# EAGLE schematic main (EAGLE 7.6.0), part 1 of 3
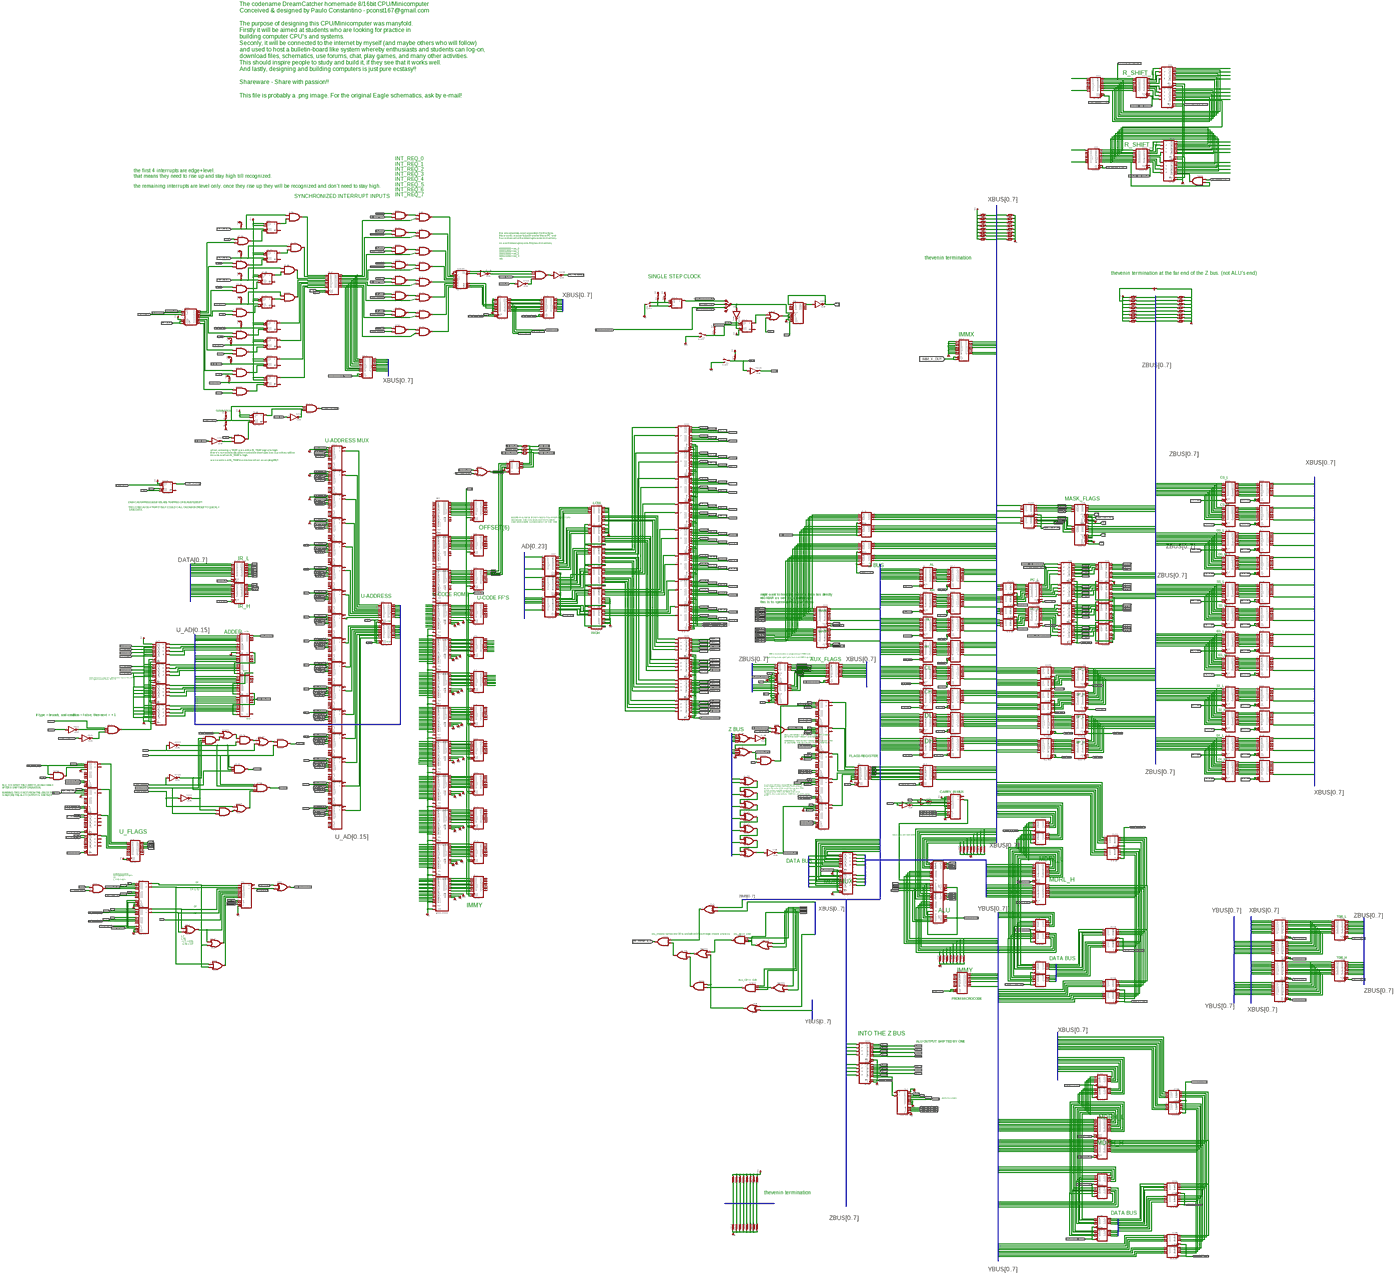
[diagram p0: schematic, sheet 1, overview]
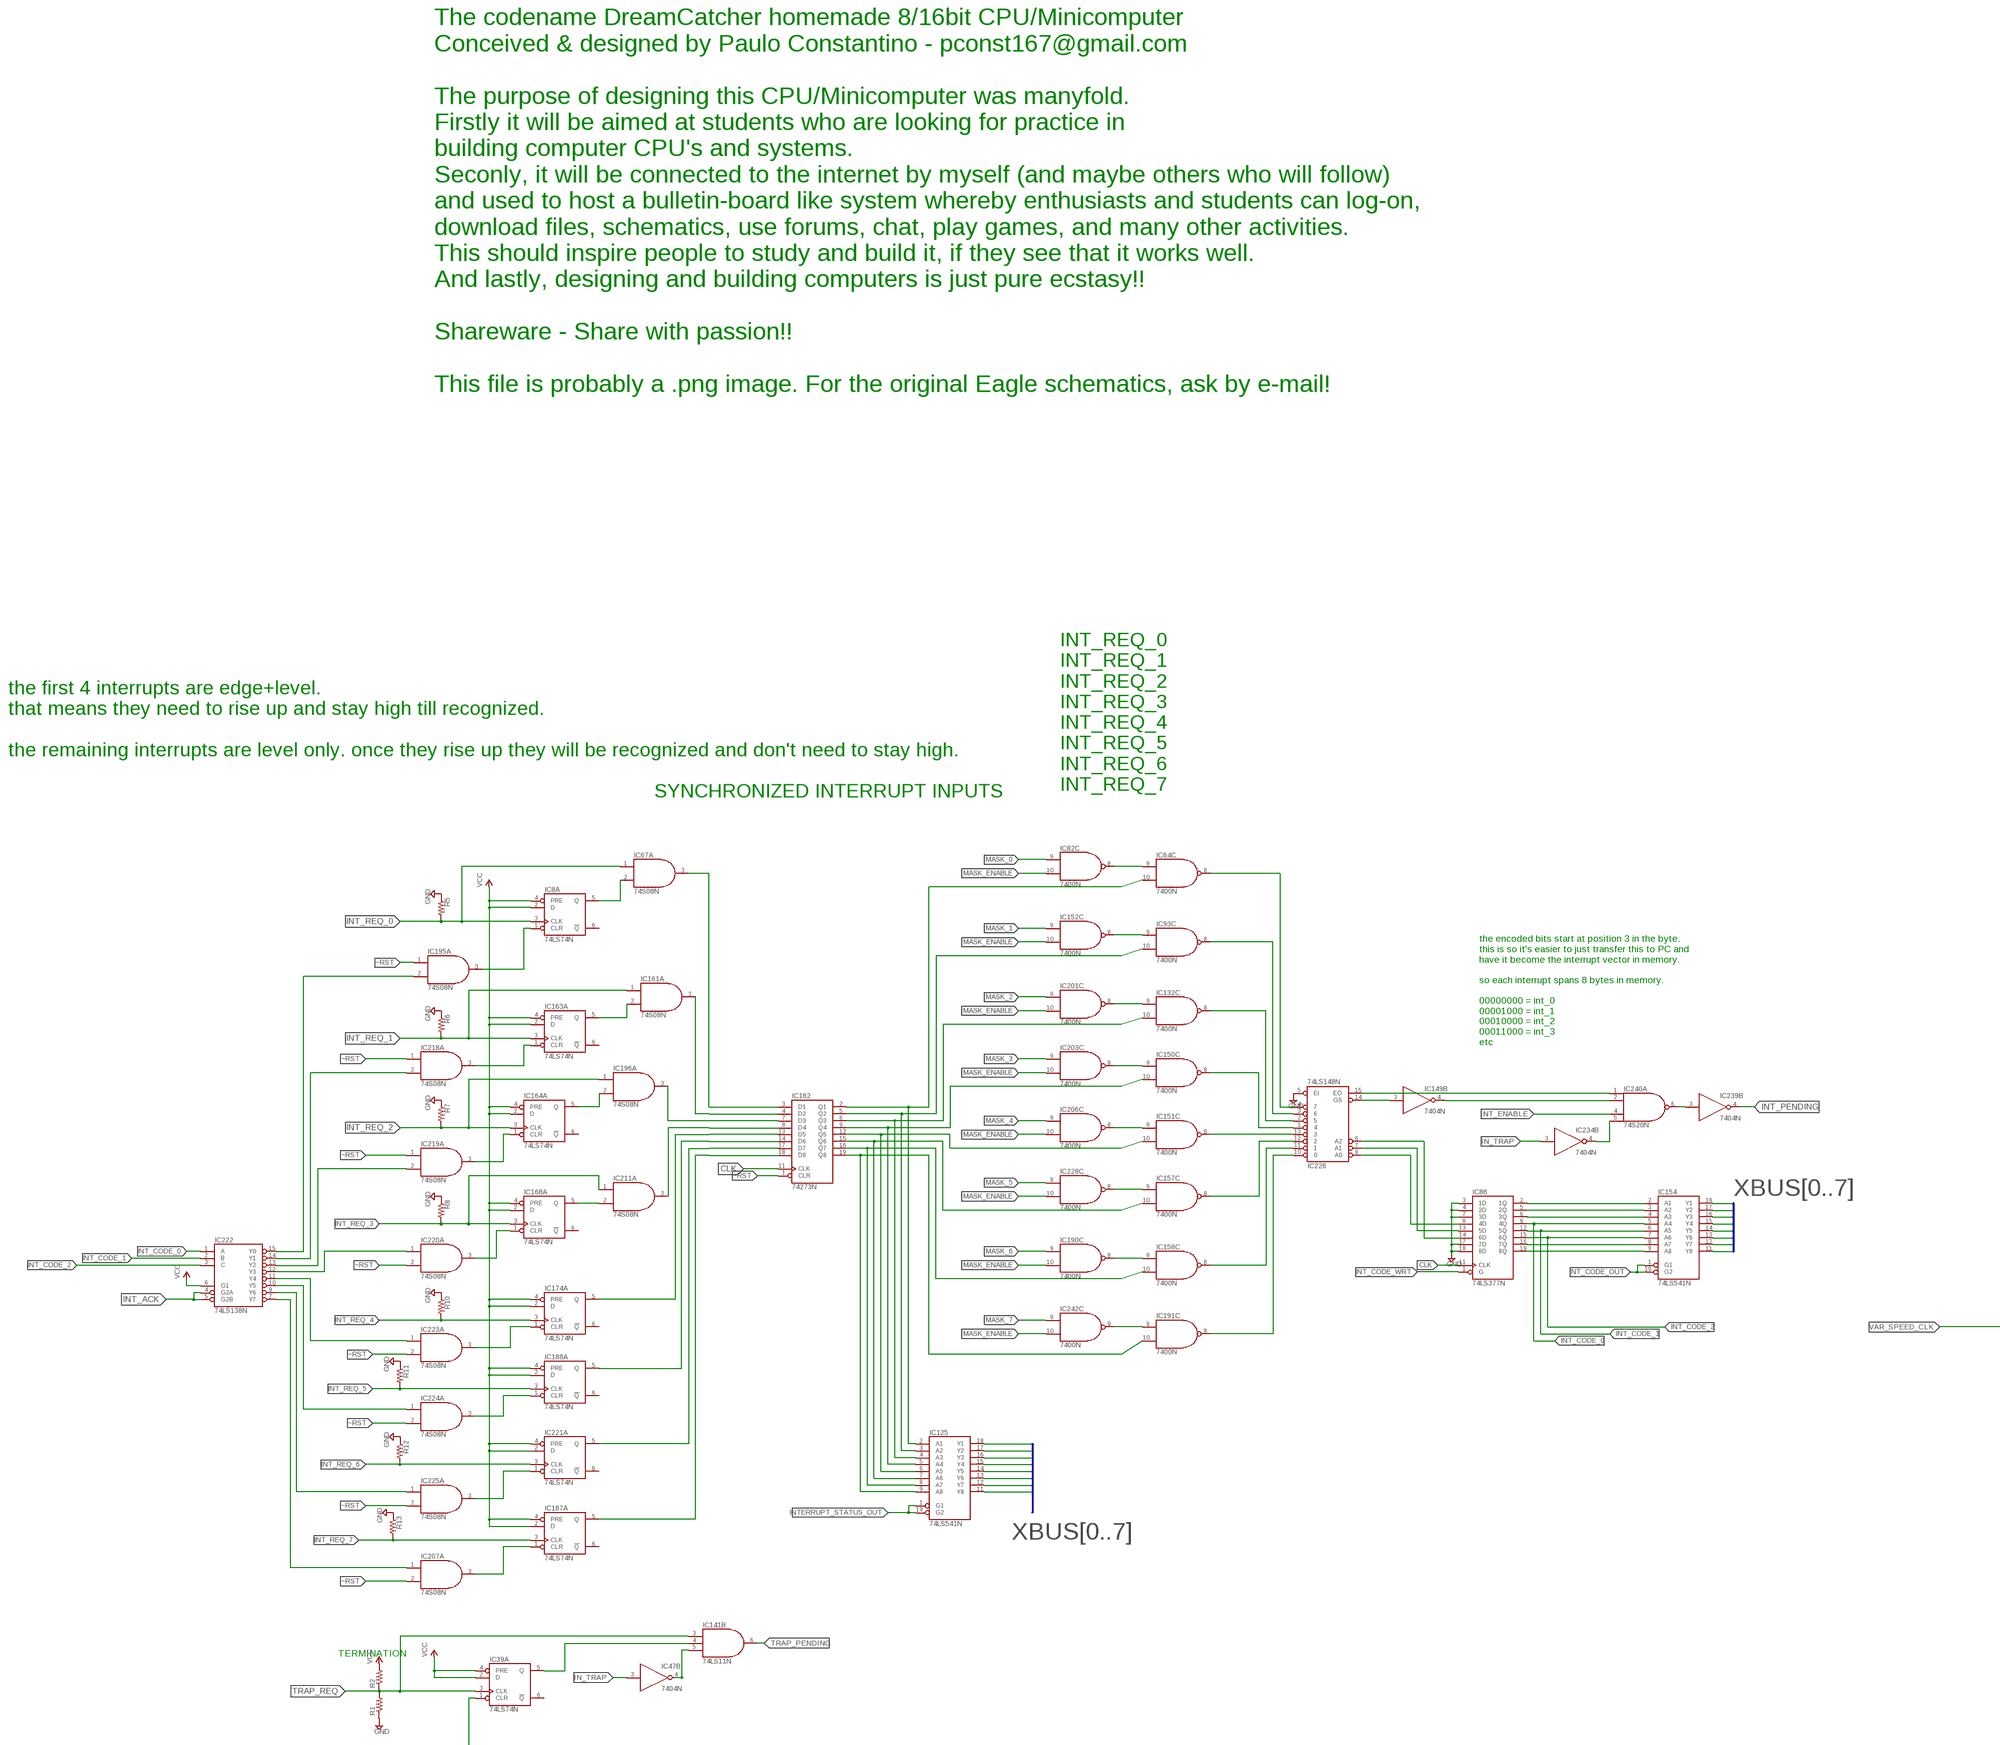
[diagram p1: schematic, sheet 1, part 1 of 7]
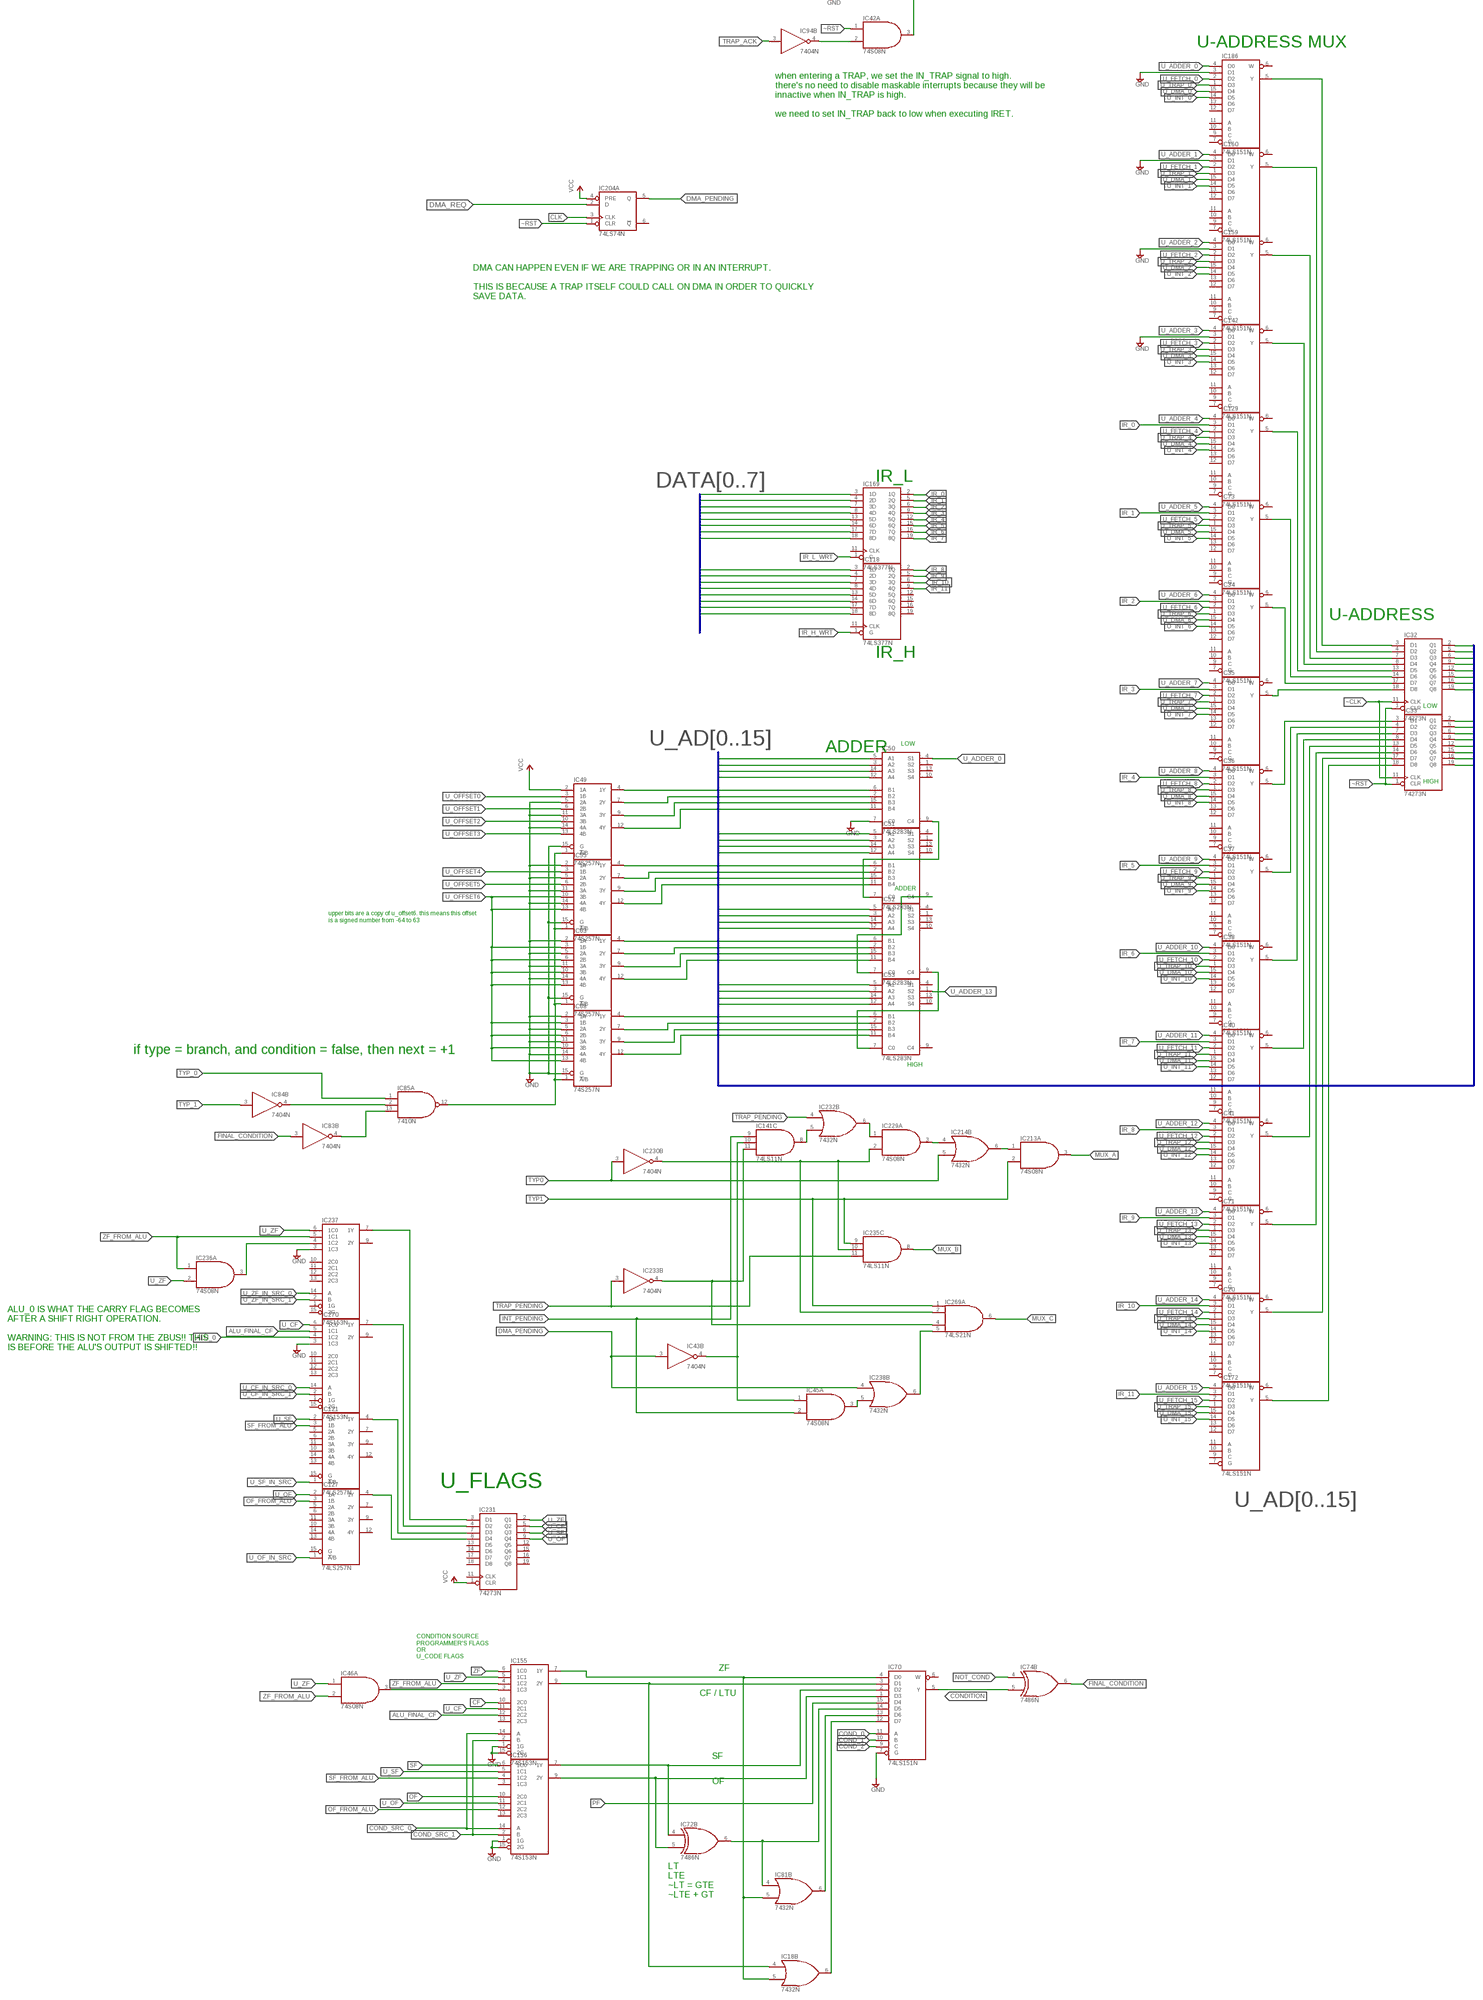
[diagram p2: schematic, sheet 1, part 2 of 7]
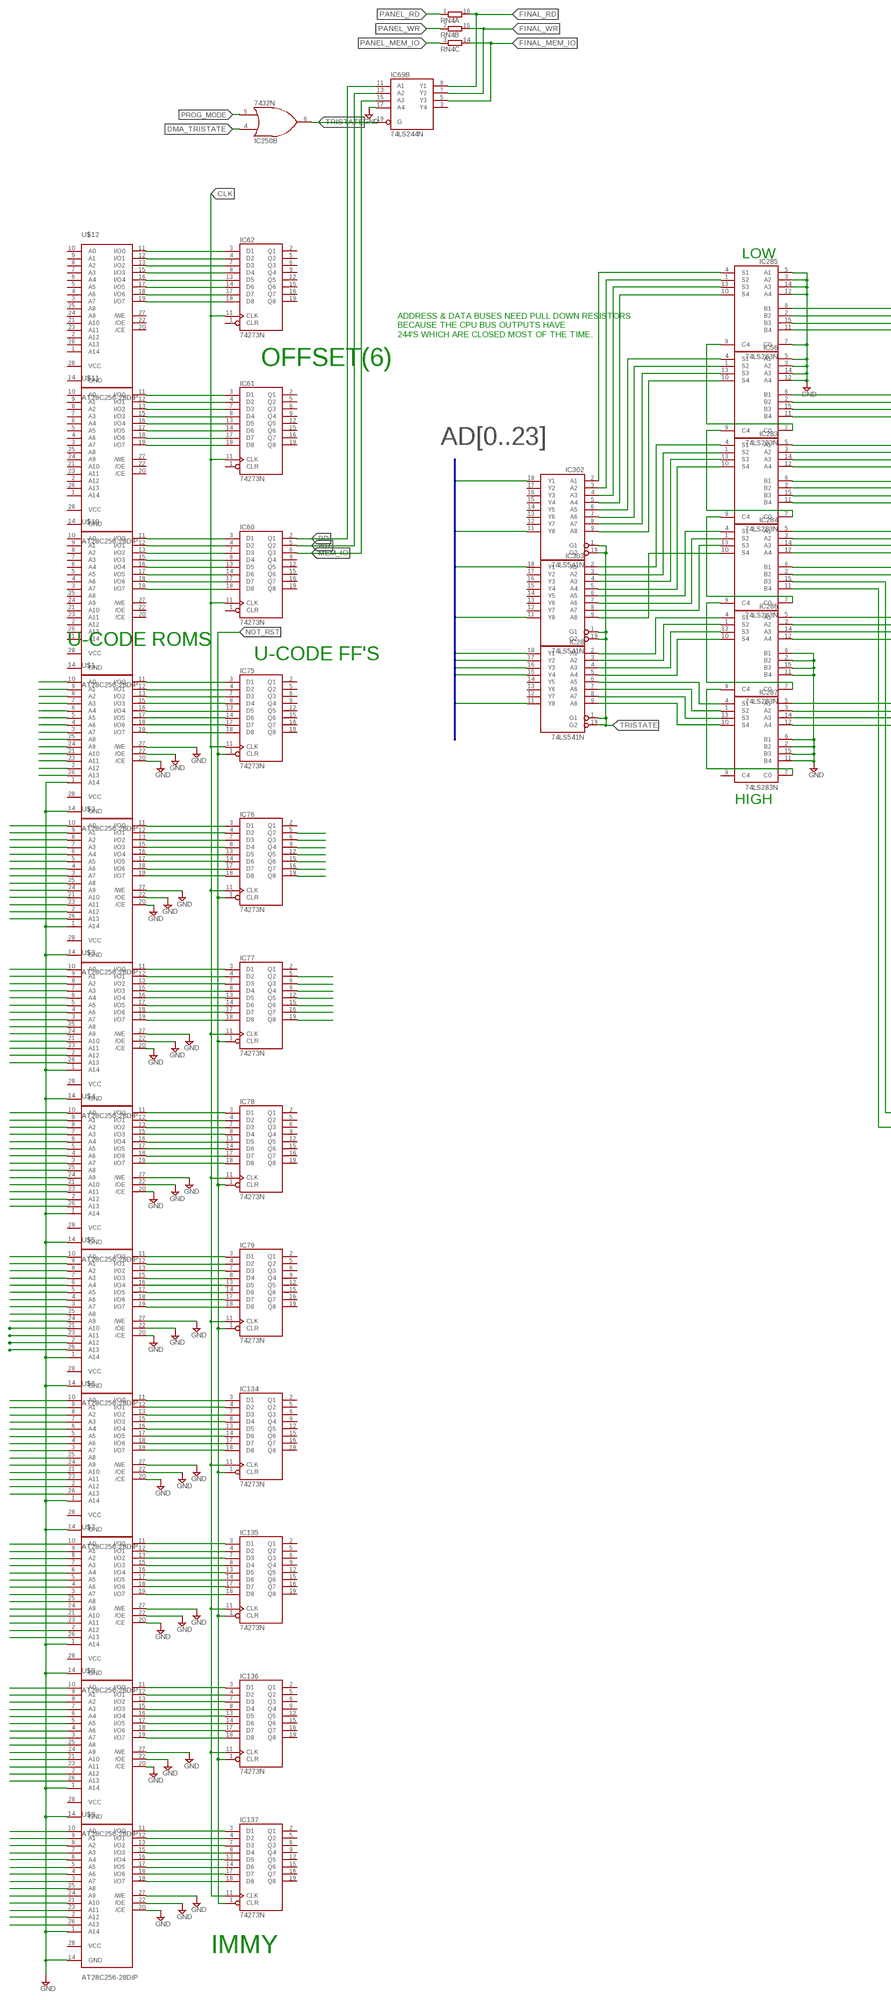
[diagram p3: schematic, sheet 1, part 3 of 7]
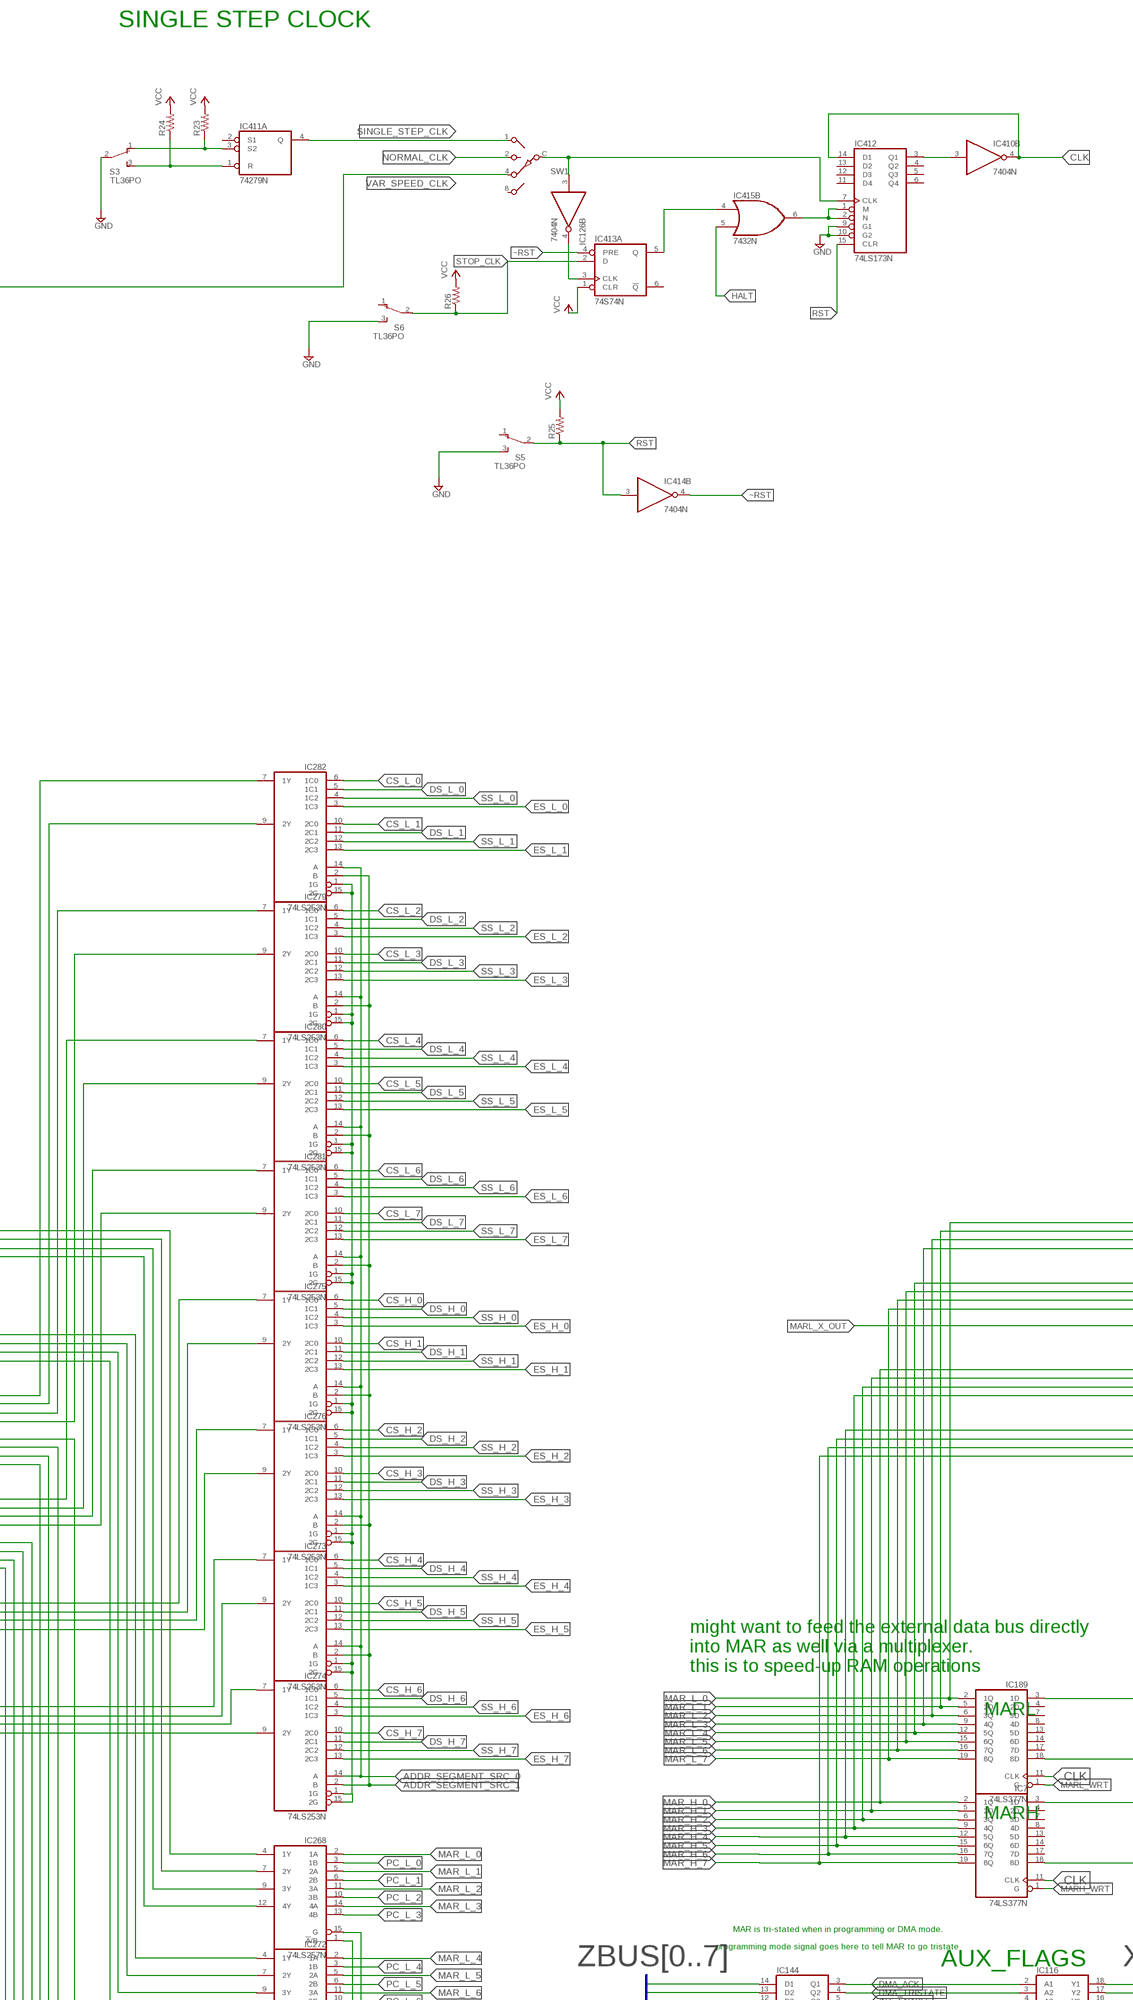
[diagram p4: schematic, sheet 1, part 4 of 7]
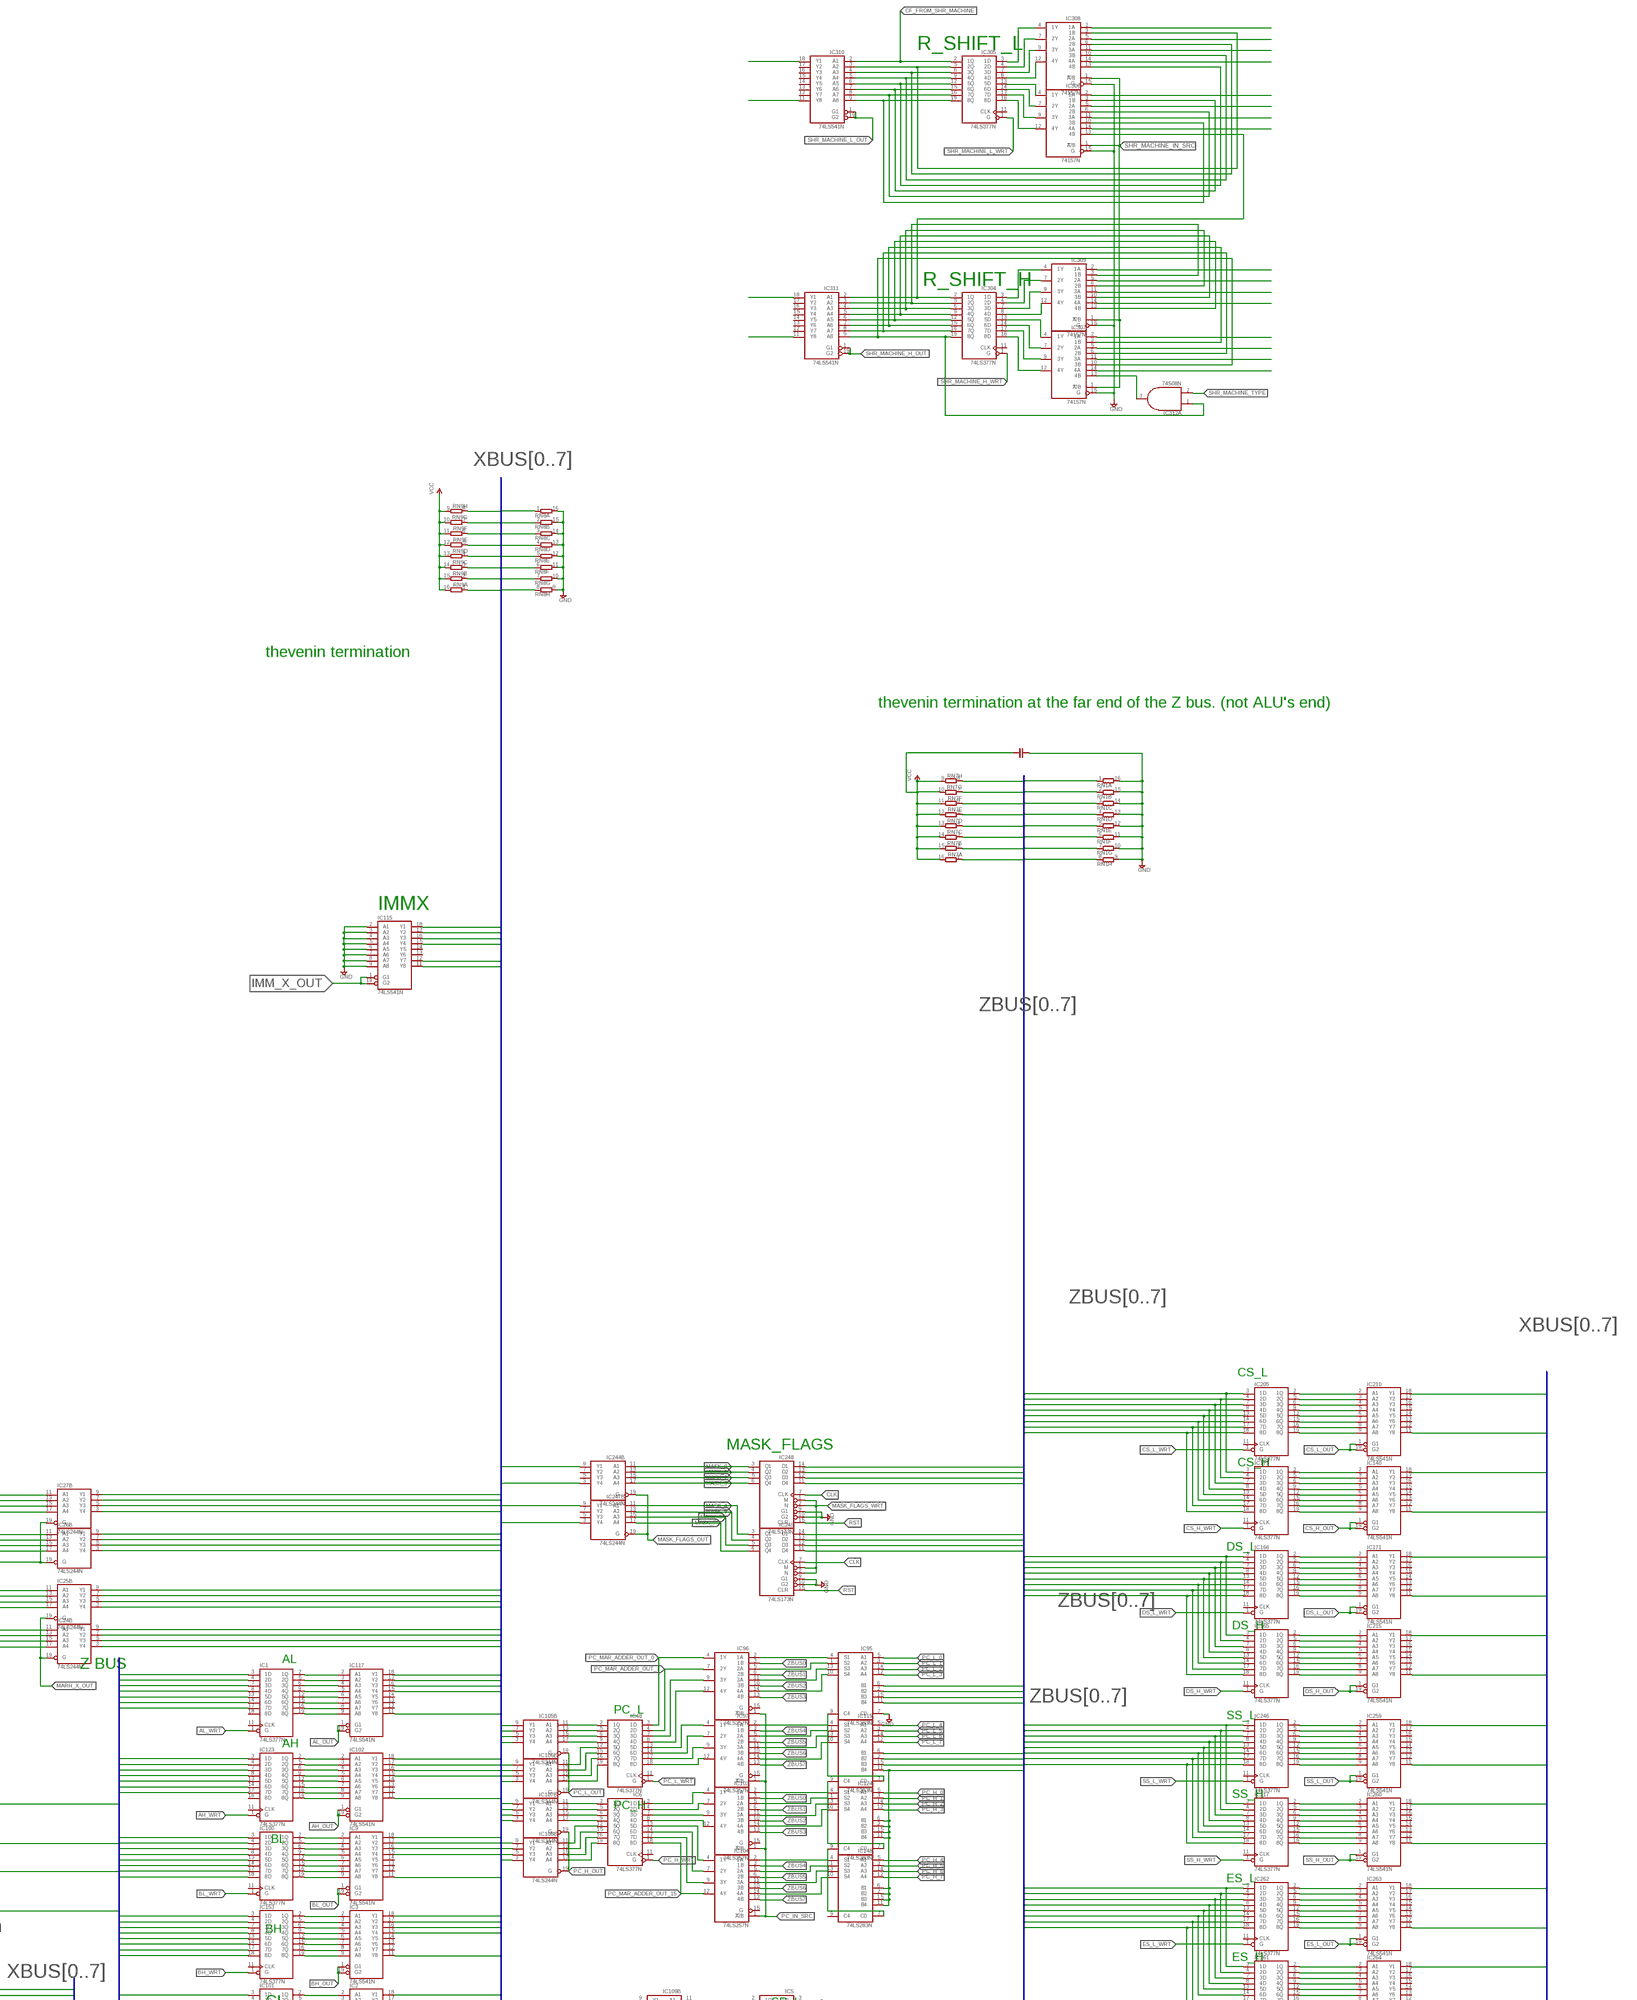
[diagram p5: schematic, sheet 1, part 5 of 7]
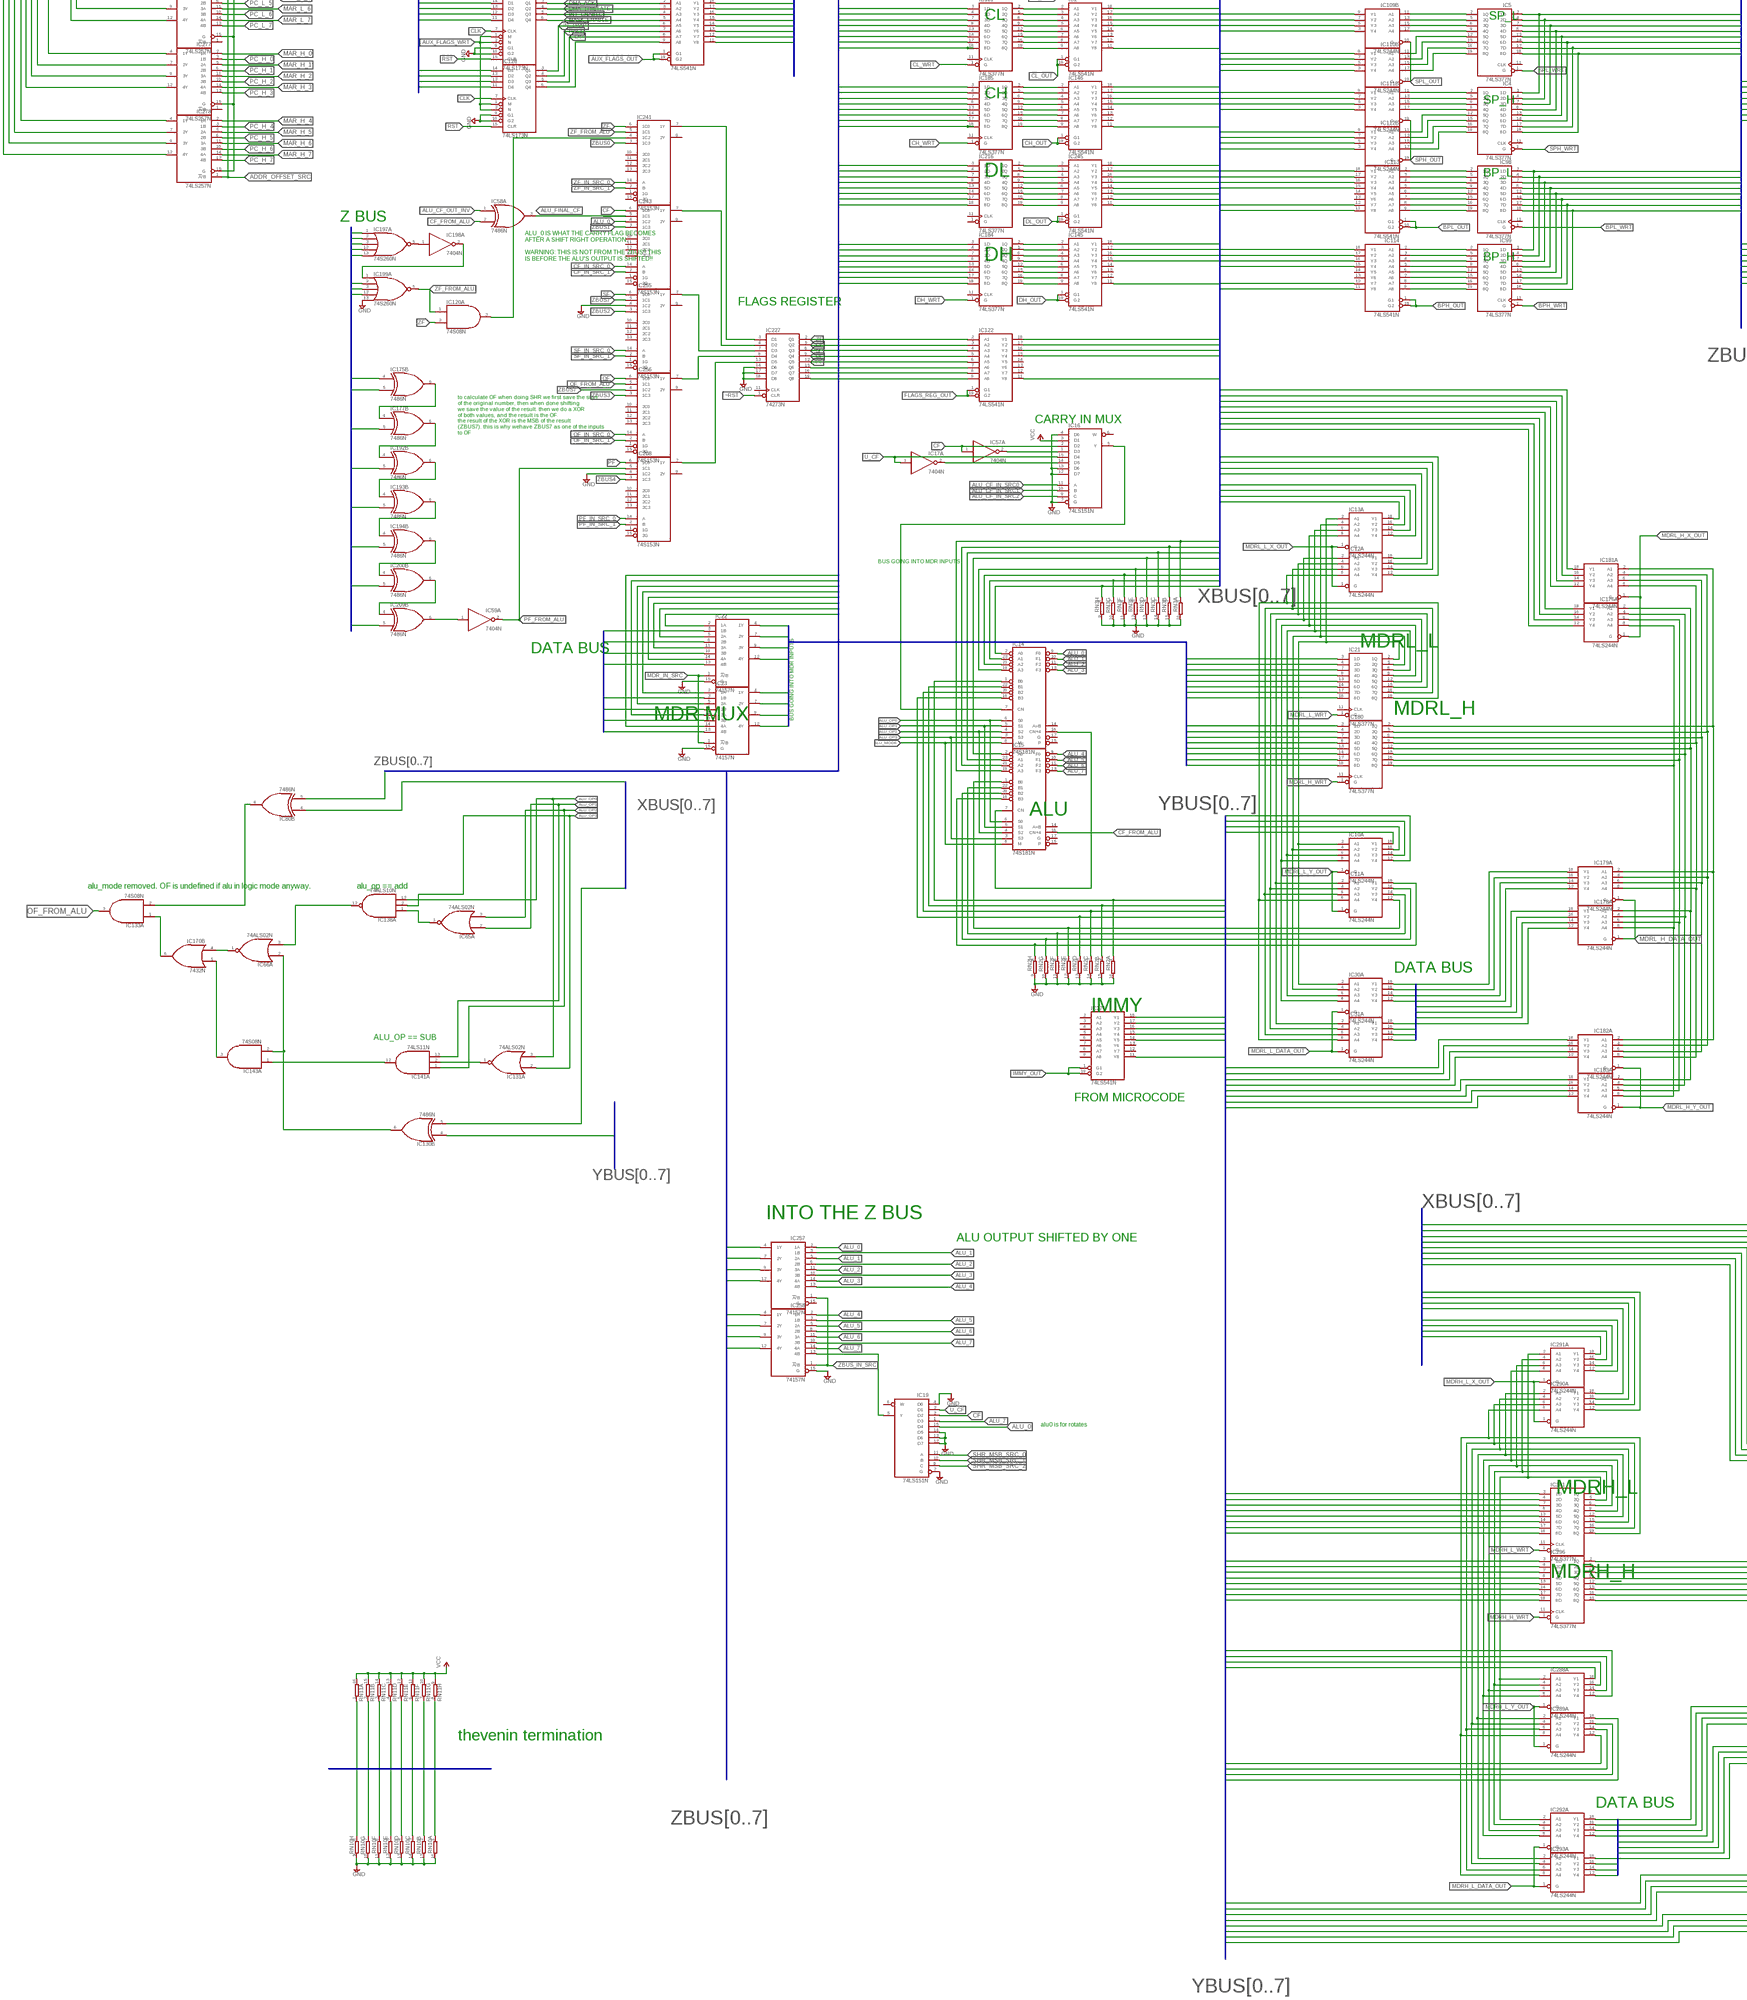
[diagram p6: schematic, sheet 1, part 6 of 7]
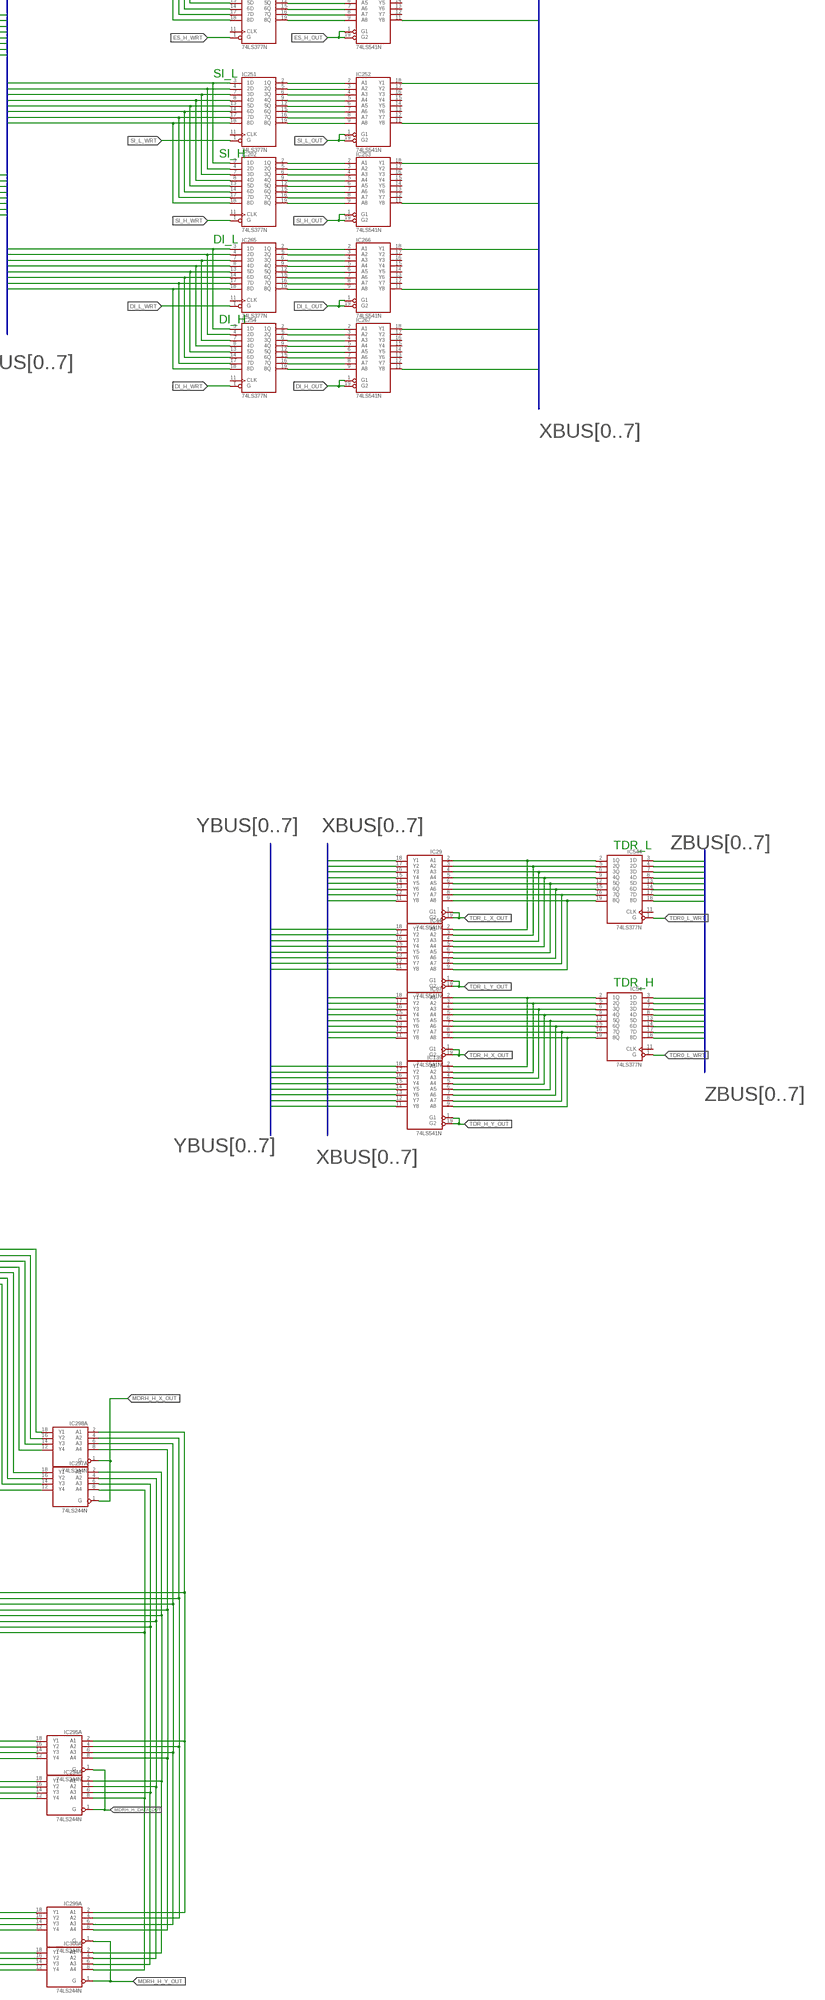
[diagram p7: schematic, sheet 1, part 7 of 7]

## Parts
IC1  74LS377N  [DIL20]
IC2  74LS541N  [DIL20]
IC3  74LS541N  [DIL20]
IC4  74LS377N  [DIL20]
IC5  74LS377N  [DIL20]
IC6  74LS377N  [DIL20]
IC7  74LS377N  [DIL20]
IC8  74LS74N  [DIL14]
IC9  74LS541N  [DIL20]
IC10  74LS244N  [DIL20]
IC11  74LS244N  [DIL20]
IC12  74LS244N  [DIL20]
IC13  74LS244N  [DIL20]
IC14  74S181N  [DIL24-6]
IC15  74S181N  [DIL24-6]
IC16  74LS151N  [DIL16]
IC17  7404N  [DIL14]
IC18  7432N  [DIL14]
IC19  74LS151N  [DIL16]
IC20  74LS151N  [DIL16]
IC21  74LS377N  [DIL20]
IC22  74157N  [DIL16]
IC23  74157N  [DIL16]
IC24  74LS244N  [DIL20]
IC25  74LS244N  [DIL20]
IC26  74LS244N  [DIL20]
IC27  74LS244N  [DIL20]
IC28  74LS541N  [DIL20]
IC29  74LS541N  [DIL20]
IC30  74LS244N  [DIL20]
IC31  74LS244N  [DIL20]
IC32  74273N  [DIL20]
IC33  74273N  [DIL20]
IC34  74LS151N  [DIL16]
IC35  74LS151N  [DIL16]
IC36  74LS151N  [DIL16]
IC37  74LS151N  [DIL16]
IC38  74LS151N  [DIL16]
IC39  74LS74N  [DIL14]
IC40  74LS151N  [DIL16]
IC41  74LS151N  [DIL16]
IC42  74S08N  [DIL14]
IC43  7404N  [DIL14]
IC44  74LS541N  [DIL20]
IC45  74S08N  [DIL14]
IC46  74S08N  [DIL14]
IC47  7404N  [DIL14]
IC48  74LS377N  [DIL20]
IC49  74S257N  [DIL16]
IC50  74LS283N  [DIL16]
IC51  74LS283N  [DIL16]
IC52  74LS283N  [DIL16]
IC53  74LS283N  [DIL16]
IC54  74LS377N  [DIL20]
IC55  74S257N  [DIL16]
IC56  74LS283N  [DIL16]
IC57  7404N  [DIL14]
IC58  7486N  [DIL14]
IC59  7404N  [DIL14]
IC60  74273N  [DIL20]
IC61  74273N  [DIL20]
IC62  74273N  [DIL20]
IC63  74S257N  [DIL16]
IC64  7400N  [DIL14]
IC65  74ALS02N  [DIL14]
IC66  74ALS02N  [DIL14]
IC67  74S08N  [DIL14]
IC68  74S257N  [DIL16]
IC69  74LS244N  [DIL20]
IC70  74LS151N  [DIL16]
IC71  74LS151N  [DIL16]
IC72  7486N  [DIL14]
IC73  74LS151N  [DIL16]
IC74  7486N  [DIL14]
IC75  74273N  [DIL20]
IC76  74273N  [DIL20]
IC77  74273N  [DIL20]
IC78  74273N  [DIL20]
IC79  74273N  [DIL20]
IC80  7486N  [DIL14]
IC81  7432N  [DIL14]
IC82  7400N  [DIL14]
IC83  7404N  [DIL14]
IC84  7404N  [DIL14]
IC85  7410N  [DIL14]
IC86  74LS377N  [DIL20]
IC87  74LS541N  [DIL20]
IC93  7400N  [DIL14]
IC94  7404N  [DIL14]
IC95  74LS283N  [DIL16]
IC96  74LS257N  [DIL16]
IC97  74LS257N  [DIL16]
IC98  74LS377N  [DIL20]
IC99  74LS377N  [DIL20]
IC100  74LS377N  [DIL20]
IC101  74LS377N  [DIL20]
IC102  74LS541N  [DIL20]
IC103  74LS257N  [DIL16]
IC104  74LS257N  [DIL16]
IC105  74LS244N  [DIL20]
IC106  74LS244N  [DIL20]
IC107  74LS244N  [DIL20]
IC108  74LS244N  [DIL20]
IC109  74LS244N  [DIL20]
IC110  74LS244N  [DIL20]
IC111  74LS244N  [DIL20]
IC112  74LS244N  [DIL20]
IC113  74LS541N  [DIL20]
IC114  74LS541N  [DIL20]
IC115  74LS541N  [DIL20]
IC116  74LS541N  [DIL20]
IC117  74LS541N  [DIL20]
IC118  74LS377N  [DIL20]
IC119  74LS283N  [DIL16]
IC120  74S08N  [DIL14]
IC121  74LS257N  [DIL16]
IC122  74LS541N  [DIL20]
IC123  74LS377N  [DIL20]
IC124  74LS283N  [DIL16]
IC125  74LS541N  [DIL20]
IC126  7404N  [DIL14]
IC127  74LS257N  [DIL16]
IC128  74LS173N  [DIL16]
IC129  74LS151N  [DIL16]
IC130  7486N  [DIL14]
IC131  74ALS02N  [DIL14]
IC132  7400N  [DIL14]
IC133  74S08N  [DIL14]
IC134  74273N  [DIL20]
IC135  74273N  [DIL20]
IC136  74273N  [DIL20]
IC137  74273N  [DIL20]
IC138  74ALS10N  [DIL14]
IC139  74LS541N  [DIL20]
IC140  74LS541N  [DIL20]
IC141  74LS11N  [DIL14]
IC142  74LS151N  [DIL16]
IC143  74S08N  [DIL14]
IC144  74LS173N  [DIL16]
IC145  74LS541N  [DIL20]
IC146  74LS541N  [DIL20]
IC148  74LS283N  [DIL16]
IC149  7404N  [DIL14]
IC150  7400N  [DIL14]
IC151  7400N  [DIL14]
IC152  7400N  [DIL14]
IC153  74LS377N  [DIL20]
IC154  74LS541N  [DIL20]
IC155  74S153N  [DIL16]
IC156  74S153N  [DIL16]
IC157  7400N  [DIL14]
IC158  7400N  [DIL14]
IC159  74LS151N  [DIL16]
IC160  74LS151N  [DIL16]
IC161  74S08N  [DIL14]
IC162  74273N  [DIL20]
IC163  74LS74N  [DIL14]
IC164  74LS74N  [DIL14]
IC165  74LS377N  [DIL20]
IC166  74LS377N  [DIL20]
IC168  74LS74N  [DIL14]
IC169  74LS377N  [DIL20]
IC170  7432N  [DIL14]
IC171  74LS541N  [DIL20]
IC172  74LS151N  [DIL16]
IC173  74LS377N  [DIL20]
IC174  74LS74N  [DIL14]
IC175  7486N  [DIL14]
IC176  74LS244N  [DIL20]
IC177  7486N  [DIL14]
IC178  74LS244N  [DIL20]
IC179  74LS244N  [DIL20]
IC180  74LS377N  [DIL20]
IC181  74LS244N  [DIL20]
IC182  74LS244N  [DIL20]
IC183  74LS244N  [DIL20]
IC184  74LS377N  [DIL20]
IC185  74LS377N  [DIL20]
IC186  74LS151N  [DIL16]
IC187  74LS74N  [DIL14]
IC188  74LS74N  [DIL14]
IC189  74LS377N  [DIL20]
IC190  7400N  [DIL14]
IC191  7400N  [DIL14]
IC192  7486N  [DIL14]
IC193  7486N  [DIL14]
IC194  7486N  [DIL14]
IC195  74S08N  [DIL14]
IC196  74S08N  [DIL14]
IC197  74S260N  [DIL14]
IC198  7404N  [DIL14]
IC199  74S260N  [DIL14]
IC200  7486N  [DIL14]
IC201  7400N  [DIL14]
IC202  74LS377N  [DIL20]
IC203  7400N  [DIL14]
IC204  74LS74N  [DIL14]
IC205  74LS377N  [DIL20]
IC206  7400N  [DIL14]
IC207  74S08N  [DIL14]
IC208  74S153N  [DIL16]
IC209  7486N  [DIL14]
IC210  74LS541N  [DIL20]
IC211  74S08N  [DIL14]
IC213  74S08N  [DIL14]
IC214  7432N  [DIL14]
IC215  74LS541N  [DIL20]
IC216  74LS377N  [DIL20]
IC217  74LS377N  [DIL20]
IC218  74S08N  [DIL14]
IC219  74S08N  [DIL14]
IC220  74S08N  [DIL14]
IC221  74LS74N  [DIL14]
IC222  74LS138N  [DIL16]
IC223  74S08N  [DIL14]
IC224  74S08N  [DIL14]
IC225  74S08N  [DIL14]
IC226  74LS148N  [DIL16]
IC227  74273N  [DIL20]
IC228  7400N  [DIL14]
IC229  74S08N  [DIL14]
IC230  7404N  [DIL14]
IC231  74273N  [DIL20]
IC232  7432N  [DIL14]
IC233  7404N  [DIL14]
IC234  7404N  [DIL14]
IC235  74LS11N  [DIL14]
IC236  74S08N  [DIL14]
IC237  74S153N  [DIL16]
IC238  7432N  [DIL14]
IC239  7404N  [DIL14]
IC240  74S20N  [DIL14]
IC241  74S153N  [DIL16]
IC242  7400N  [DIL14]
IC243  74S153N  [DIL16]
IC244  74LS244N  [DIL20]
IC245  74LS541N  [DIL20]
IC246  74LS377N  [DIL20]
IC247  74LS244N  [DIL20]
IC248  74LS173N  [DIL16]
IC249  74LS173N  [DIL16]
IC250  7432N  [DIL14]
IC251  74LS377N  [DIL20]
IC252  74LS541N  [DIL20]
IC253  74LS541N  [DIL20]
IC254  74LS377N  [DIL20]
IC255  74S153N  [DIL16]
IC256  74S153N  [DIL16]
IC257  74157N  [DIL16]
IC258  74157N  [DIL16]
IC259  74LS541N  [DIL20]
IC260  74LS541N  [DIL20]
IC261  74LS377N  [DIL20]
IC262  74LS377N  [DIL20]
IC263  74LS541N  [DIL20]
IC264  74LS541N  [DIL20]
IC265  74LS377N  [DIL20]
IC266  74LS541N  [DIL20]
IC267  74LS541N  [DIL20]
IC268  74LS257N  [DIL16]
IC269  74LS21N  [DIL14]
IC270  74S153N  [DIL16]
IC271  74LS541N  [DIL20]
IC272  74LS257N  [DIL16]
IC273  74LS253N  [DIL16]
IC274  74LS253N  [DIL16]
IC275  74LS253N  [DIL16]
IC276  74LS253N  [DIL16]
IC277  74LS257N  [DIL16]
IC278  74LS257N  [DIL16]
IC279  74LS253N  [DIL16]
IC280  74LS253N  [DIL16]
IC281  74LS253N  [DIL16]
IC282  74LS253N  [DIL16]
IC283  74LS283N  [DIL16]
IC284  74LS283N  [DIL16]
IC285  74LS283N  [DIL16]
IC286  74LS283N  [DIL16]
IC287  74LS283N  [DIL16]
IC288  74LS244N  [DIL20]
IC289  74LS244N  [DIL20]
IC290  74LS244N  [DIL20]
IC291  74LS244N  [DIL20]
IC292  74LS244N  [DIL20]
IC293  74LS244N  [DIL20]
IC294  74LS244N  [DIL20]
IC295  74LS244N  [DIL20]
IC296  74LS377N  [DIL20]
IC297  74LS244N  [DIL20]
IC298  74LS244N  [DIL20]
IC299  74LS244N  [DIL20]
IC300  74LS244N  [DIL20]
IC301  74LS377N  [DIL20]
IC302  74LS541N  [DIL20]
IC303  74LS541N  [DIL20]
IC304  74LS377N  [DIL20]
IC305  74LS377N  [DIL20]
IC306  74157N  [DIL16]
IC307  74157N  [DIL16]
IC308  74157N  [DIL16]
IC309  74157N  [DIL16]
IC310  74LS541N  [DIL20]
IC311  74LS541N  [DIL20]
IC312  74S08N  [DIL14]
IC410  7404N  [DIL14]
IC411  74279N  [DIL16]
IC412  74LS173N  [DIL16]
IC413  74S74N  [DIL14]
IC414  7404N  [DIL14]
IC415  7432N  [DIL14]
IC544  74LS377N  [DIL20]
R1  R-US_0204/7  [0204/7]
R2  R-US_0204/7  [0204/7]
R5  R-US_0204/7  [0204/7]
R6  R-US_0204/7  [0204/7]
R7  R-US_0204/7  [0204/7]
R8  R-US_0204/7  [0204/7]
R10  R-US_0204/7  [0204/7]
R11  R-US_0204/7  [0204/7]
R12  R-US_0204/7  [0204/7]
R13  R-US_0204/7  [0204/7]
R23  R-US_0204/2V  [0204V]
R24  R-US_0204/2V  [0204V]
R25  R-US_0204/2V  [0204V]
R26  R-US_0204/2V  [0204V]
RN1  8R-N  [DIL16]
RN2  8R-N  [DIL16]
RN3  8R-N  [DIL16]
RN4  8R-N  [DIL16]
RN7  8R-N  [DIL16]
RN8  8R-N  [DIL16]
RN9  8R-N  [DIL16]
RN10  8R-N  [DIL16]
RN11  8R-N  [DIL16]
S3  TL36PO  [TL3XPO]
S5  TL36PO  [TL3XPO]
S6  TL36PO  [TL3XPO]
SW1  SW-C10  [SW-C10]
U$1  AT28C256-28DIP  [DIL28-6]
U$2  AT28C256-28DIP  [DIL28-6]
U$3  AT28C256-28DIP  [DIL28-6]
U$4  AT28C256-28DIP  [DIL28-6]
U$5  AT28C256-28DIP  [DIL28-6]
U$6  AT28C256-28DIP  [DIL28-6]
U$7  AT28C256-28DIP  [DIL28-6]
U$8  AT28C256-28DIP  [DIL28-6]
U$9  AT28C256-28DIP  [DIL28-6]
U$10  AT28C256-28DIP  [DIL28-6]
U$11  AT28C256-28DIP  [DIL28-6]
U$12  AT28C256-28DIP  [DIL28-6]

## Nets
45435: IC18.5(B:I1) IC70.4(D0) IC81.5(B:I1) IC155.7(1Y)
345345: IC70.2(D2) IC72.4(B:I0) IC156.7(1Y)
634354: IC18.4(B:I0) IC70.3(D1) IC155.9(2Y)
654654: IC122.8(A7) IC227.16(Q7)
4654654: IC70.1(D3) IC72.5(B:I1) IC156.9(2Y)
5434534: IC122.7(A6) IC227.15(Q6)
AD0: IC302.18(Y1)
AD7: IC302.11(Y8)
AD8: IC303.18(Y1)
AD15: IC303.11(Y8)
AD16: IC28.18(Y1)
AD17: IC28.17(Y2)
AD18: IC28.16(Y3)
AD19: IC28.15(Y4)
AD23: IC28.11(Y8)
ADDR_OFFSET_SRC: IC268.1(!A!/B) IC278.1(!A!/B)
ADDR_SEGMENT_SRC_0: IC273.14(A) IC274.14(A) IC275.14(A) IC276.14(A) IC279.14(A) IC280.14(A) IC281.14(A) IC282.14(A)
ADDR_SEGMENT_SRC_1: IC273.2(B) IC274.2(B) IC275.2(B) IC276.2(B) IC279.2(B) IC280.2(B) IC281.2(B) IC282.2(B)
AH_OUT: IC102.1(G1) IC102.19(G2)
AH_WRT: IC123.1(G)
AL_OUT: IC117.1(G1) IC117.19(G2)
AL_WRT: IC1.1(G)
ALU_0: IC14.9(F0) IC243.4(1C2) IC257.2(1A) IC270.4(1C2)
ALU_1: IC14.10(F1) IC257.3(1B) IC257.5(2A)
ALU_2: IC14.11(F2) IC257.6(2B) IC257.11(3A)
ALU_3: IC14.13(F3) IC257.10(3B) IC257.14(4A)
ALU_4: IC15.9(F0) IC258.2(1A)
ALU_5: IC15.10(F1) IC258.5(2A)
ALU_6: IC15.11(F2) IC258.11(3A)
ALU_7: IC15.13(F3) IC258.10(3B) IC258.14(4A)
ALU_CF_IN_SRC0: IC16.11(A)
ALU_CF_IN_SRC1: IC16.10(B)
ALU_CF_IN_SRC2: IC16.9(C)
ALU_CF_OUT_INV: IC58.1(A:I0)
ALU_FINAL_CF: IC58.3(A:O) IC155.12(2C2) IC243.5(1C1) IC270.5(1C1)
ALU_MODE: IC14.8(M) IC15.8(M)
ALU_OP0: IC14.6(S0) IC15.6(S0) IC131.3(A:I1) IC138.13(A:I2)
ALU_OP1: IC14.5(S1) IC15.5(S1) IC65.2(A:I0) IC141.13(A:I2)
ALU_OP2: IC14.4(S2) IC15.4(S2) IC65.3(A:I1) IC141.1(A:I0)
ALU_OP3: IC14.3(S3) IC15.3(S3) IC131.2(A:I0) IC138.2(A:I1)
AUX_FLAGS_OUT: IC116.1(G1) IC116.19(G2)
AUX_FLAGS_WRT: IC128.1(M) IC128.2(N) IC144.1(M) IC144.2(N)
BH_OUT: IC3.1(G1) IC3.19(G2)
BH_WRT: IC153.1(G)
BL_OUT: IC9.1(G1) IC9.19(G2)
BL_WRT: IC100.1(G)
BPH_OUT: IC114.1(G1)
BPH_WRT: IC99.1(G)
BPL_OUT: IC113.1(G1)
BPL_WRT: IC98.1(G)
CF: IC16.2(D2) IC57.1(A:I) IC122.3(A2) IC155.10(2C0) IC227.5(Q2) IC243.6(1C0)
CF_FROM_ALU: IC15.16(CN+4) IC58.2(A:I1)
CF_FROM_SHR_MACHINE: IC305.2(1Q) IC310.2(A1)
CF_IN_SRC_0: IC243.14(A)
CF_IN_SRC_1: IC243.2(B)
CH_OUT: IC146.1(G1) IC146.19(G2)
CH_WRT: IC185.1(G)
CL_OUT: IC2.1(G1) IC2.19(G2)
CL_WRT: IC101.1(G)
CLK: IC7.11(CLK) IC60.11(CLK) IC61.11(CLK) IC62.11(CLK) IC75.11(CLK) IC76.11(CLK) IC77.11(CLK) IC78.11(CLK) IC79.11(CLK) IC86.11(CLK) IC128.7(CLK) IC134.11(CLK) IC135.11(CLK) IC136.11(CLK) IC137.11(CLK) IC144.7(CLK) IC162.11(CLK) IC189.11(CLK) IC204.3(A:CLK) IC248.7(CLK) IC249.7(CLK) IC410.4(B:O) IC412.14(D1)
COND_0: IC70.11(A)
COND_1: IC70.10(B)
COND_2: IC70.9(C)
COND_SRC_0: IC155.14(A) IC156.14(A)
COND_SRC_1: IC155.2(B) IC156.2(B)
CONDITION: IC70.5(Y) IC74.5(B:I1)
CS_H_0: IC275.6(1C0)
CS_H_1: IC275.10(2C0)
CS_H_2: IC276.6(1C0)
CS_H_3: IC276.10(2C0)
CS_H_4: IC273.6(1C0)
CS_H_5: IC273.10(2C0)
CS_H_6: IC274.6(1C0)
CS_H_7: IC274.10(2C0)
CS_H_OUT: IC140.1(G1) IC140.19(G2)
CS_H_WRT: IC173.1(G)
CS_L_0: IC282.6(1C0)
CS_L_1: IC282.10(2C0)
CS_L_2: IC279.6(1C0)
CS_L_3: IC279.10(2C0)
CS_L_4: IC280.6(1C0)
CS_L_5: IC280.10(2C0)
CS_L_6: IC281.6(1C0)
CS_L_7: IC281.10(2C0)
CS_L_OUT: IC210.1(G1) IC210.19(G2)
CS_L_WRT: IC205.1(G)
DATA0: IC118.3(1D) IC169.3(1D) IC179.18(A:Y1) IC295.18(A:Y1)
DATA1: IC118.4(2D) IC169.4(2D) IC179.16(A:Y2) IC295.16(A:Y2)
DATA2: IC118.7(3D) IC169.7(3D) IC179.14(A:Y3) IC295.14(A:Y3)
DATA3: IC118.8(4D) IC169.8(4D) IC179.12(A:Y4) IC295.12(A:Y4)
DATA4: IC118.13(5D) IC169.13(5D) IC178.18(A:Y1) IC294.18(A:Y1)
DATA5: IC118.14(6D) IC169.14(6D) IC178.16(A:Y2) IC294.16(A:Y2)
DATA6: IC118.17(7D) IC169.17(7D) IC178.14(A:Y3) IC294.14(A:Y3)
DATA7: IC118.18(8D) IC169.18(8D) IC178.12(A:Y4) IC294.12(A:Y4)
DH_OUT: IC145.1(G1) IC145.19(G2)
DH_WRT: IC184.1(G)
DI_H_OUT: IC267.1(G1) IC267.19(G2)
DI_H_WRT: IC254.1(G)
DI_L_OUT: IC266.1(G1) IC266.19(G2)
DI_L_WRT: IC265.1(G)
DIR: IC116.8(A7) IC128.5(Q3)
DL_OUT: IC245.1(G1) IC245.19(G2)
DMA_ACK: IC116.2(A1) IC144.3(Q1)
DMA_PENDING: IC43.3(B:I) IC204.5(A:Q) IC238.4(B:I0)
DMA_REQ: IC204.2(A:D)
DMA_TRISTATE: IC116.3(A2) IC144.4(Q2) IC250.4(B:I0)
DS_H_0: IC275.5(1C1)
DS_H_1: IC275.11(2C1)
DS_H_2: IC276.5(1C1)
DS_H_3: IC276.11(2C1)
DS_H_4: IC273.5(1C1)
DS_H_5: IC273.11(2C1)
DS_H_6: IC274.5(1C1)
DS_H_7: IC274.11(2C1)
DS_H_OUT: IC215.1(G1) IC215.19(G2)
DS_H_WRT: IC165.1(G)
DS_L_0: IC282.5(1C1)
DS_L_1: IC282.11(2C1)
DS_L_2: IC279.5(1C1)
DS_L_3: IC279.11(2C1)
DS_L_4: IC280.5(1C1)
DS_L_5: IC280.11(2C1)
DS_L_6: IC281.5(1C1)
DS_L_7: IC281.11(2C1)
DS_L_OUT: IC171.1(G1) IC171.19(G2)
DS_L_WRT: IC166.1(G)
ES_H_0: IC275.3(1C3)
ES_H_1: IC275.13(2C3)
ES_H_2: IC276.3(1C3)
ES_H_3: IC276.13(2C3)
ES_H_4: IC273.3(1C3)
ES_H_5: IC273.13(2C3)
ES_H_6: IC274.3(1C3)
ES_H_7: IC274.13(2C3)
ES_H_OUT: IC264.1(G1) IC264.19(G2)
ES_H_WRT: IC261.1(G)
ES_L_0: IC282.3(1C3)
ES_L_1: IC282.13(2C3)
ES_L_2: IC279.3(1C3)
ES_L_3: IC279.13(2C3)
ES_L_4: IC280.3(1C3)
ES_L_5: IC280.13(2C3)
ES_L_6: IC281.3(1C3)
ES_L_7: IC281.13(2C3)
ES_L_OUT: IC263.1(G1) IC263.19(G2)
ES_L_WRT: IC262.1(G)
FINAL_CONDITION: IC74.6(B:O) IC83.3(B:I)
FINAL_MEM_IO: IC69.5(B:Y3) RN4.14
FINAL_RD: IC69.9(B:Y1) RN4.16
FINAL_WR: IC69.7(B:Y2) RN4.15
FLAGS_REG_OUT: IC122.1(G1) IC122.19(G2)
GND: IC16.4(D0) IC16.7(G) IC16.12(D7) IC16.13(D6) IC19.7(G) IC19.12(D7) IC19.13(D6) IC19.14(D5) IC22.15(G) IC23.15(G) IC49.5(2A) IC49.11(3A) IC49.14(4A) IC49.15(G) IC50.7(C0) IC55.2(1A) IC55.5(2A) IC55.11(3A) IC55.14(4A) IC55.15(G) IC56.3(A2) IC56.5(A1) IC56.12(A4) IC56.14(A3) IC63.2(1A) IC63.5(2A) IC63.11(3A) IC63.14(4A) IC63.15(G) IC68.2(1A) IC68.5(2A) IC68.11(3A) IC68.14(4A) IC68.15(G) IC69.17(B:A4) IC70.7(G) IC86.3(1D) IC86.4(2D) IC86.7(3D) IC86.17(7D) IC86.18(8D) IC95.7(C0) IC115.2(A1) IC115.3(A2) IC115.4(A3) IC115.5(A4) IC115.6(A5) IC115.7(A6) IC115.8(A7) IC115.9(A8) IC128.9(G1) IC128.10(G2) IC142.3(D1) IC144.9(G1) IC144.10(G2) IC155.1(1G) IC155.15(2G) IC156.1(1G) IC156.15(2G) IC159.3(D1) IC160.3(D1) IC186.3(D1) IC199.13(A:I4) IC208.4(1C2) IC226.5(EI) IC227.14(D6) IC227.17(D7) IC227.18(D8) IC237.3(1C3) IC248.9(G1) IC248.10(G2) IC249.9(G1) IC249.10(G2) IC255.4(1C2) IC258.15(G) IC270.3(1C3) IC285.3(A2) IC285.5(A1) IC285.7(C0) IC285.12(A4) IC285.14(A3) IC286.2(B2) IC286.6(B1) IC286.11(B4) IC286.15(B3) IC287.2(B2) IC287.6(B1) IC287.11(B4) IC287.15(B3) IC306.15(G) IC307.15(G) IC308.15(G) IC309.15(G) IC412.9(G1) IC412.10(G2) R1.1 R5.1 R6.1 R7.1 R8.1 R10.1 R11.1 R12.1 R13.1 RN1.9 RN1.10 RN1.11 RN1.12 RN1.13 RN1.14 RN1.15 RN1.16 RN2.9 RN2.10 RN2.11 RN2.12 RN2.13 RN2.14 RN2.15 RN2.16 RN3.9 RN3.10 RN3.11 RN3.12 RN3.13 RN3.14 RN3.15 RN3.16 RN8.9 RN8.10 RN8.11 RN8.12 RN8.13 RN8.14 RN8.15 RN8.16 RN10.9 RN10.10 RN10.11 RN10.12 RN10.13 RN10.14 RN10.15 RN10.16 S3.2(P) S5.3(S) S6.3(S) U$1.1(A14) U$1.14(GND) U$1.20(/CE) U$1.22(/OE) U$1.27(/WE) U$2.1(A14) U$2.14(GND) U$2.20(/CE) U$2.22(/OE) U$2.27(/WE) U$3.1(A14) U$3.14(GND) U$3.20(/CE) U$3.22(/OE) U$3.27(/WE) U$4.1(A14) U$4.14(GND) U$4.20(/CE) U$4.22(/OE) U$4.27(/WE) U$5.1(A14) U$5.14(GND) U$5.20(/CE) U$5.22(/OE) U$5.27(/WE) U$6.1(A14) U$6.14(GND) U$6.20(/CE) U$6.22(/OE) U$6.27(/WE) U$7.1(A14) U$7.14(GND) U$7.20(/CE) U$7.22(/OE) U$7.27(/WE) U$8.1(A14) U$8.14(GND) U$8.20(/CE) U$8.22(/OE) U$8.27(/WE) U$9.1(A14) U$9.14(GND) U$9.20(/CE) U$9.22(/OE) U$9.27(/WE)
HALT: IC116.7(A6) IC128.4(Q2) IC415.5(B:I1)
IMM_X_OUT: IC115.1(G1) IC115.19(G2)
IMMY_OUT: IC271.1(G1) IC271.19(G2)
IN_TRAP: IC47.3(B:I) IC116.6(A5) IC128.3(Q1) IC234.3(B:I)
INT_ACK: IC222.4(G2A) IC222.5(G2B)
INT_CODE_0: IC86.9(4Q) IC154.5(A4) IC222.1(A)
INT_CODE_1: IC86.12(5Q) IC86.13(5D) IC154.6(A5) IC222.2(B) IC226.7(A1)
INT_CODE_2: IC86.14(6D) IC86.15(6Q) IC154.7(A6) IC222.3(C) IC226.6(A2)
INT_CODE_OUT: IC154.1(G1) IC154.19(G2)
INT_CODE_WRT: IC86.1(G)
INT_ENABLE: IC116.4(A3) IC144.5(Q3) IC240.4(A:I2)
INT_PENDING: IC45.2(A:I1) IC141.9(C:I0) IC239.4(B:O)
INT_REQ_0: IC8.3(A:CLK) IC67.1(A:I0) R5.2
INT_REQ_1: IC161.1(A:I0) IC163.3(A:CLK) R6.2
INT_REQ_2: IC164.3(A:CLK) IC196.1(A:I0) R7.2
INT_REQ_3: IC168.3(A:CLK) IC211.1(A:I0) R8.2
INT_REQ_4: IC174.3(A:CLK) R10.2
INT_REQ_5: IC188.3(A:CLK) R11.2
INT_REQ_6: IC221.3(A:CLK) R12.2
INT_REQ_7: IC187.3(A:CLK) R13.2
INTERRUPT_STATUS_OUT: IC125.1(G1) IC125.19(G2)
IR_0: IC129.3(D1) IC169.2(1Q)
IR_1: IC73.3(D1) IC169.5(2Q)
IR_2: IC34.3(D1) IC169.6(3Q)
IR_3: IC35.3(D1) IC169.9(4Q)
IR_4: IC36.3(D1) IC169.12(5Q)
IR_5: IC37.3(D1) IC169.15(6Q)
IR_6: IC38.3(D1) IC169.16(7Q)
IR_7: IC40.3(D1) IC169.19(8Q)
IR_8: IC41.3(D1) IC118.2(1Q)
IR_9: IC71.3(D1) IC118.5(2Q)
IR_10: IC20.3(D1) IC118.6(3Q)
IR_11: IC118.9(4Q) IC172.3(D1)
IR_H_WRT: IC118.1(G)
IR_L_WRT: IC169.1(G)
MAR_H_0: IC277.2(1A)
MAR_H_1: IC277.5(2A)
MAR_H_2: IC277.11(3A)
MAR_H_3: IC277.14(4A)
MAR_H_4: IC278.2(1A)
MAR_H_5: IC278.5(2A)
MAR_H_6: IC278.11(3A)
MAR_H_7: IC278.14(4A)
MAR_L_0: IC268.2(1A)
MAR_L_1: IC268.5(2A)
MAR_L_2: IC268.11(3A)
MAR_L_3: IC268.14(4A)
MAR_L_4: IC272.2(1A)
MAR_L_5: IC272.5(2A)
MAR_L_6: IC272.11(3A)
MAR_L_7: IC272.14(4A)
MARH_WRT: IC7.1(G)
MARH_X_OUT: IC24.19(B:G) IC25.19(B:G)
MARL_0: IC27.11(B:A1) IC189.2(1Q)
MARL_1: IC27.13(B:A2) IC189.5(2Q)
MARL_WRT: IC189.1(G)
MARL_X_OUT: IC26.19(B:G) IC27.19(B:G)
MASK_0: IC82.9(C:I0) IC244.11(B:A1) IC248.3(Q1)
MASK_1: IC152.9(C:I0) IC244.13(B:A2) IC248.4(Q2)
MASK_2: IC201.9(C:I0) IC244.15(B:A3) IC248.5(Q3)
MASK_3: IC203.9(C:I0) IC244.17(B:A4) IC248.6(Q4)
MASK_4: IC206.9(C:I0) IC247.11(B:A1) IC249.3(Q1)
MASK_5: IC228.9(C:I0) IC247.13(B:A2) IC249.4(Q2)
MASK_6: IC190.9(C:I0) IC247.15(B:A3) IC249.5(Q3)
MASK_7: IC242.9(C:I0) IC247.17(B:A4) IC249.6(Q4)
MASK_ENABLE: IC82.10(C:I1) IC116.5(A4) IC144.6(Q4) IC152.10(C:I1) IC190.10(C:I1) IC201.10(C:I1) IC203.10(C:I1) IC206.10(C:I1) IC228.10(C:I1) IC242.10(C:I1)
MASK_FLAGS_OUT: IC244.19(B:G) IC247.19(B:G)
MASK_FLAGS_WRT: IC248.1(M) IC248.2(N) IC249.1(M) IC249.2(N)
MDR_IN_BUS0: IC21.3(1D) IC180.3(1D)
MDR_IN_BUS1: IC21.4(2D) IC180.4(2D)
MDR_IN_BUS2: IC21.7(3D) IC180.7(3D)
MDR_IN_BUS3: IC21.8(4D) IC180.8(4D)
MDR_IN_BUS4: IC21.13(5D) IC180.13(5D)
MDR_IN_BUS5: IC21.14(6D) IC180.14(6D)
MDR_IN_BUS6: IC21.17(7D) IC180.17(7D)
MDR_IN_BUS7: IC21.18(8D) IC180.18(8D)
MDR_IN_BUS8: IC296.3(1D) IC301.3(1D)
MDR_IN_BUS9: IC296.4(2D) IC301.4(2D)
MDR_IN_BUS10: IC296.7(3D) IC301.7(3D)
MDR_IN_BUS11: IC296.8(4D) IC301.8(4D)
MDR_IN_BUS12: IC296.13(5D) IC301.13(5D)
MDR_IN_BUS13: IC296.14(6D) IC301.14(6D)
MDR_IN_BUS14: IC296.17(7D) IC301.17(7D)
MDR_IN_BUS15: IC296.18(8D) IC301.18(8D)
MDR_IN_SRC: IC22.1(!A!/B) IC23.1(!A!/B)
MDRH_H_DATA_OUT: IC294.1(A:G) IC295.1(A:G)
MDRH_H_WRT: IC296.1(G)
MDRH_H_X_OUT: IC297.1(A:G) IC298.1(A:G)
MDRH_H_Y_OUT: IC299.1(A:G) IC300.1(A:G)
MDRH_L_DATA_OUT: IC292.1(A:G) IC293.1(A:G)
MDRH_L_WRT: IC301.1(G)
MDRH_L_X_OUT: IC290.1(A:G) IC291.1(A:G)
MDRH_L_Y_OUT: IC288.1(A:G) IC289.1(A:G)
MDRL_H_DATA_OUT: IC178.1(A:G) IC179.1(A:G)
MDRL_H_WRT: IC180.1(G)
MDRL_H_X_OUT: IC176.1(A:G) IC181.1(A:G)
MDRL_H_Y_OUT: IC182.1(A:G) IC183.1(A:G)
MDRL_L_DATA_OUT: IC30.1(A:G) IC31.1(A:G)
MDRL_L_WRT: IC21.1(G)
MDRL_L_X_OUT: IC12.1(A:G) IC13.1(A:G)
MDRL_L_Y_OUT: IC10.1(A:G) IC11.1(A:G)
MEM_IO: IC60.6(Q3) IC69.15(B:A3)
MUX_A: IC213.3(A:O)
MUX_B: IC235.8(C:O)
N$1: IC1.2(1Q) IC117.2(A1)
N$2: IC1.5(2Q) IC117.3(A2)
N$3: IC1.6(3Q) IC117.4(A3)
N$4: IC1.9(4Q) IC117.5(A4)
N$5: IC1.12(5Q) IC117.6(A5)
N$6: IC1.15(6Q) IC117.7(A6)
N$7: IC102.8(A7) IC123.16(7Q)
N$8: IC1.19(8Q) IC117.9(A8)
N$9: IC29.6(A5) IC44.6(A5) IC544.12(5Q)
N$10: IC80.6(B:O) IC133.2(A:I1)
N$11: IC46.3(A:O) IC155.3(1C3)
N$12: IC49.4(1Y) IC50.6(B1)
N$13: IC9.2(A1) IC100.2(1Q)
N$14: IC49.7(2Y) IC50.2(B2)
N$15: IC9.3(A2) IC100.5(2Q)
N$16: IC9.4(A3) IC100.6(3Q)
N$17: IC9.5(A4) IC100.9(4Q)
N$18: IC9.6(A5) IC100.12(5Q)
N$19: IC9.7(A6) IC100.15(6Q)
N$20: IC9.8(A7) IC100.16(7Q)
N$21: IC9.9(A8) IC100.19(8Q)
N$22: IC16.1(D3) IC57.2(A:O)
N$23: IC65.1(A:O) IC138.1(A:I0)
N$24: IC143.3(A:O) IC170.5(B:I1)
N$25: IC2.2(A1) IC101.2(1Q)
N$26: IC2.3(A2) IC101.5(2Q)
N$27: IC2.4(A3) IC101.6(3Q)
N$28: IC2.5(A4) IC101.9(4Q)
N$29: IC2.6(A5) IC101.12(5Q)
N$30: IC2.7(A6) IC101.15(6Q)
N$31: IC2.8(A7) IC101.16(7Q)
N$32: IC2.9(A8) IC101.19(8Q)
N$33: IC16.14(D5) IC17.2(A:O)
N$34: IC131.1(A:O) IC141.2(A:I1)
N$35: IC49.9(3Y) IC50.15(B3)
N$36: IC49.12(4Y) IC50.11(B4)
N$37: IC51.6(B1) IC55.4(1Y)
N$38: IC51.2(B2) IC55.7(2Y)
N$39: IC51.15(B3) IC55.9(3Y)
N$40: IC51.11(B4) IC55.12(4Y)
N$41: IC227.3(D1) IC241.7(1Y)
N$42: IC179.2(A:A1) IC180.2(1Q) IC181.2(A:A1) IC182.2(A:A1)
N$43: IC179.4(A:A2) IC180.5(2Q) IC181.4(A:A2) IC182.4(A:A2)
N$44: IC179.6(A:A3) IC180.6(3Q) IC181.6(A:A3) IC182.6(A:A3)
N$45: IC179.8(A:A4) IC180.9(4Q) IC181.8(A:A4) IC182.8(A:A4)
N$46: IC176.2(A:A1) IC178.2(A:A1) IC180.12(5Q) IC183.2(A:A1)
N$47: IC176.4(A:A2) IC178.4(A:A2) IC180.15(6Q) IC183.4(A:A2)
N$48: IC176.6(A:A3) IC178.6(A:A3) IC180.16(7Q) IC183.6(A:A3)
N$49: IC234.4(B:O) IC240.5(A:I3)
N$50: IC66.2(A:I0) IC130.6(B:O) IC143.2(A:I1)
N$51: IC176.8(A:A4) IC178.8(A:A4) IC180.19(8Q) IC183.8(A:A4)
N$52: IC27.15(B:A3) IC189.6(3Q)
N$53: IC27.17(B:A4) IC189.9(4Q)
N$54: IC26.11(B:A1) IC189.12(5Q)
N$55: IC26.13(B:A2) IC189.15(6Q)
N$56: IC26.15(B:A3) IC189.16(7Q)
N$57: IC26.17(B:A4) IC189.19(8Q)
N$58: IC7.2(1Q) IC25.11(B:A1)
N$59: IC7.5(2Q) IC25.13(B:A2)
N$60: IC7.6(3Q) IC25.15(B:A3)
N$61: IC7.9(4Q) IC25.17(B:A4)
N$62: IC7.12(5Q) IC24.11(B:A1)
N$63: IC7.15(6Q) IC24.13(B:A2)
N$64: IC7.16(7Q) IC24.15(B:A3)
N$65: IC52.6(B1) IC63.4(1Y)
N$66: IC122.9(A8) IC227.19(Q8)
N$67: IC5.2(1Q) IC109.11(B:A1)
N$68: IC5.5(2Q) IC109.13(B:A2)
N$69: IC5.6(3Q) IC109.15(B:A3)
N$70: IC5.9(4Q) IC109.17(B:A4)
N$71: IC5.12(5Q) IC110.11(B:A1)
N$72: IC5.15(6Q) IC110.13(B:A2)
N$73: IC7.19(8Q) IC24.17(B:A4)
N$74: IC52.2(B2) IC63.7(2Y)
N$75: IC52.15(B3) IC63.9(3Y)
N$76: IC54.2(1Q) IC87.2(A1) IC139.2(A1)
N$77: IC75.3(D1) U$1.11(I/O0)
N$78: IC42.2(A:I1) IC94.4(B:O)
N$79: IC32.3(D1) IC186.5(Y)
N$80: IC83.4(B:O) IC85.13(A:I2)
N$81: IC53.15(B3) IC68.9(3Y)
N$82: IC66.1(A:O) IC170.4(B:I0)
N$83: IC10.2(A:A1) IC13.2(A:A1) IC21.2(1Q) IC30.2(A:A1)
N$84: IC133.1(A:I0) IC170.6(B:O)
N$85: IC66.3(A:I1) IC138.12(A:O)
N$86: IC59.1(A:I) IC209.6(B:O)
N$87: IC145.2(A1) IC184.2(1Q)
N$88: IC227.4(D2) IC243.7(1Y)
N$89: IC141.12(A:O) IC143.1(A:I0)
N$90: IC227.7(D3) IC255.7(1Y)
N$91: IC53.11(B4) IC68.12(4Y)
N$92: IC227.8(D4) IC256.7(1Y)
N$93: IC208.7(1Y) IC227.13(D5)
N$94: IC213.1(A:I0) IC214.6(B:O)
N$95: IC39.1(A:CLR) IC42.3(A:O)
N$96: IC231.3(D1) IC237.7(1Y)
N$97: IC32.4(D2) IC160.5(Y)
N$98: IC231.4(D2) IC270.7(1Y)
N$99: IC236.3(A:O) IC237.4(1C2)
N$100: IC127.4(1Y) IC231.8(D4)
N$101: IC121.4(1Y) IC231.7(D3)
N$102: IC126.4(B:O) IC413.3(A:CLK)
N$103: IC19.5(Y) IC258.13(4B)
N$104: IC305.3(1D) IC308.4(1Y)
N$105: IC305.4(2D) IC308.7(2Y)
N$106: IC99.19(8Q) IC114.9(A8)
N$107: IC14.16(CN+4) IC15.7(CN)
N$108: IC39.5(A:Q) IC141.4(B:I1)
N$109: IC145.3(A2) IC184.5(2Q)
N$110: IC1.16(7Q) IC117.8(A7)
N$111: IC145.4(A3) IC184.6(3Q)
N$112: IC145.5(A4) IC184.9(4Q)
N$113: IC32.7(D3) IC159.5(Y)
N$114: IC56.7(C0) IC285.9(C4)
N$115: IC278.4(1Y) IC284.6(B1)
N$116: IC278.7(2Y) IC284.2(B2)
N$117: IC278.9(3Y) IC284.15(B3)
N$118: IC278.12(4Y) IC284.11(B4)
N$119: IC56.4(S1) IC302.6(A5)
N$120: IC56.1(S2) IC302.7(A6)
N$121: IC56.13(S3) IC302.8(A7)
N$122: IC56.10(S4) IC302.9(A8)
N$123: IC283.4(S1) IC303.2(A1)
N$124: IC283.1(S2) IC303.3(A2)
N$125: IC283.13(S3) IC303.4(A3)
N$126: IC283.10(S4) IC303.5(A4)
N$127: IC284.4(S1) IC303.6(A5)
N$128: IC284.1(S2) IC303.7(A6)
N$129: IC284.13(S3) IC303.8(A7)
N$130: IC214.4(B:I0) IC229.3(A:O)
N$131: IC64.10(C:I1) IC125.2(A1) IC162.2(Q1)
N$132: IC10.4(A:A2) IC13.4(A:A2) IC21.5(2Q) IC30.4(A:A2)
N$133: IC64.9(C:I0) IC82.8(C:O)
N$134: IC10.6(A:A3) IC13.6(A:A3) IC21.6(3Q) IC30.6(A:A3)
N$135: IC145.6(A5) IC184.12(5Q)
N$136: IC145.7(A6) IC184.15(6Q)
N$137: IC10.8(A:A4) IC13.8(A:A4) IC21.9(4Q) IC30.8(A:A4)
N$138: IC11.2(A:A1) IC12.2(A:A1) IC21.12(5Q) IC31.2(A:A1)
N$139: IC145.8(A7) IC184.16(7Q)
N$140: IC11.4(A:A2) IC12.4(A:A2) IC21.15(6Q) IC31.4(A:A2)
N$141: IC11.6(A:A3) IC12.6(A:A3) IC21.16(7Q) IC31.6(A:A3)
N$142: IC145.9(A8) IC184.19(8Q)
N$143: IC5.16(7Q) IC110.15(B:A3)
N$144: IC52.11(B4) IC63.12(4Y)
N$145: IC53.6(B1) IC68.4(1Y)
N$146: IC5.19(8Q) IC110.17(B:A4)
N$147: IC53.2(B2) IC68.7(2Y)
N$148: IC48.7(3D) IC96.9(3Y)
N$149: IC48.8(4D) IC96.12(4Y)
N$150: IC8.5(A:Q) IC67.2(A:I1)
N$151: IC4.2(1Q) IC111.11(B:A1)
N$152: IC49.1(!A!/B) IC55.1(!A!/B) IC63.1(!A!/B) IC68.1(!A!/B) IC85.12(A:O)
N$153: IC32.8(D4) IC142.5(Y)
N$154: IC84.4(B:O) IC85.2(A:I1)
N$155: IC268.15(G) IC272.15(G) IC277.15(G) IC278.15(G)
N$156: IC48.13(5D) IC97.4(1Y)
N$157: IC48.14(6D) IC97.7(2Y)
N$158: IC48.17(7D) IC97.9(3Y)
N$159: IC48.18(8D) IC97.12(4Y)
N$160: IC6.3(1D) IC103.4(1Y)
N$161: IC6.4(2D) IC103.7(2Y)
N$162: IC6.7(3D) IC103.9(3Y)
N$163: IC6.8(4D) IC103.12(4Y)
N$164: IC11.8(A:A4) IC12.8(A:A4) IC21.19(8Q) IC31.8(A:A4)
N$165: IC6.13(5D) IC104.4(1Y)
N$166: IC6.14(6D) IC104.7(2Y)
N$167: IC54.5(2Q) IC87.3(A2) IC139.3(A2)
N$168: IC6.17(7D) IC104.9(3Y)
N$169: IC10.18(A:Y1)
N$170: IC10.16(A:Y2)
N$171: IC10.14(A:Y3)
N$172: IC10.12(A:Y4)
N$173: IC229.2(A:I1) IC230.4(B:O) IC235.10(C:I1) IC269.2(A:I1)
N$174: IC32.13(D5) IC129.5(Y)
N$175: IC32.14(D6) IC73.5(Y)
N$176: IC14.7(CN) IC16.5(Y)
N$177: IC13.18(A:Y1)
N$178: IC13.16(A:Y2)
N$179: IC13.14(A:Y3)
N$180: IC13.12(A:Y4)
N$181: IC12.18(A:Y1)
N$182: IC12.16(A:Y2)
N$183: IC12.14(A:Y3)
N$184: IC12.12(A:Y4)
N$185: IC32.17(D7) IC34.5(Y)
N$186: IC32.18(D8) IC35.5(Y)
N$187: IC33.3(D1) IC36.5(Y)
N$188: IC33.4(D2) IC37.5(Y)
N$189: IC33.7(D3) IC38.5(Y)
N$190: IC33.8(D4) IC40.5(Y)
N$191: IC22.7(2Y)
N$192: IC22.9(3Y)
N$193: IC22.12(4Y)
N$194: IC23.4(1Y)
N$195: IC23.7(2Y)
N$196: IC23.9(3Y)
N$197: IC23.12(4Y)
N$198: IC22.3(1B)
N$199: IC22.6(2B)
N$200: IC30.18(A:Y1)
N$201: IC30.16(A:Y2)
N$202: IC95.4(S1) IC96.2(1A)
N$203: IC30.14(A:Y3)
N$204: IC30.12(A:Y4)
N$205: IC95.1(S2) IC96.5(2A)
N$206: IC31.18(A:Y1)
N$207: IC31.16(A:Y2)
N$208: IC31.14(A:Y3)
N$209: IC31.12(A:Y4)
N$210: IC22.4(1Y)
N$211: IC22.10(3B)
N$212: IC22.13(4B)
N$213: IC23.3(1B)
N$214: IC23.6(2B)
N$215: IC23.10(3B)
N$216: IC23.13(4B)
N$217: IC116.9(A8) IC128.6(Q4)
N$218: IC33.13(D5) IC41.5(Y)
N$219: IC33.14(D6) IC71.5(Y)
N$220: IC67.3(A:O) IC162.3(D1)
N$221: IC102.6(A5) IC123.12(5Q)
N$222: IC195.2(A:I1) IC222.15(Y0)
N$223: IC8.1(A:CLR) IC195.3(A:O)
N$224: IC95.13(S3) IC96.11(3A)
N$225: IC20.5(Y) IC33.17(D7)
N$226: IC64.8(C:O) IC226.4
N$227: IC95.10(S4) IC96.14(4A)
N$228: IC33.18(D8) IC172.5(Y)
N$229: IC102.7(A6) IC123.15(6Q)
N$230: IC205.2(1Q) IC210.2(A1)
N$231: IC120.3(A:O) IC241.4(1C2)
N$232: IC97.2(1A) IC119.4(S1)
N$233: IC97.5(2A) IC119.1(S2)
N$234: IC205.5(2Q) IC210.3(A2)
N$235: IC102.9(A8) IC123.19(8Q)
N$236: IC102.2(A1) IC123.2(1Q)
N$237: IC102.3(A2) IC123.5(2Q)
N$238: IC102.4(A3) IC123.6(3Q)
N$239: IC205.6(3Q) IC210.4(A3)
N$240: IC205.9(4Q) IC210.5(A4)
N$241: IC205.12(5Q) IC210.6(A5)
N$242: IC205.15(6Q) IC210.7(A6)
N$243: IC205.16(7Q) IC210.8(A7)
N$244: IC205.19(8Q) IC210.9(A8)
N$245: IC140.2(A1) IC173.2(1Q)
N$246: IC140.3(A2) IC173.5(2Q)
N$247: IC140.4(A3) IC173.6(3Q)
N$248: IC140.5(A4) IC173.9(4Q)
N$249: IC102.5(A4) IC123.9(4Q)
N$250: IC140.6(A5) IC173.12(5Q)
N$251: U$2.10(A0)
N$252: U$2.9(A1)
N$253: U$2.8(A2)
N$254: U$2.7(A3)
N$255: U$2.6(A4)
N$256: U$2.5(A5)
N$257: U$2.4(A6)
N$258: U$2.3(A7)
N$259: U$2.25(A8)
N$260: U$2.24(A9)
N$261: U$2.21(A10)
N$262: U$2.23(A11)
N$263: U$2.2(A12)
N$264: U$2.26(A13)
N$265: U$3.10(A0)
N$266: U$3.9(A1)
N$267: U$3.8(A2)
N$268: U$3.7(A3)
N$269: U$3.6(A4)
N$270: U$3.5(A5)
N$271: U$3.4(A6)
N$272: U$3.3(A7)
N$273: U$3.25(A8)
N$274: U$3.24(A9)
N$275: U$3.21(A10)
N$276: U$3.23(A11)
N$277: U$3.2(A12)
N$278: U$3.26(A13)
N$279: U$4.10(A0)
N$280: U$4.9(A1)
N$281: U$4.8(A2)
N$282: U$4.7(A3)
N$283: U$4.6(A4)
N$284: U$4.5(A5)
N$285: U$4.4(A6)
N$286: U$4.3(A7)
N$287: U$4.25(A8)
N$288: U$4.24(A9)
N$289: U$4.21(A10)
N$290: U$4.23(A11)
N$291: U$4.2(A12)
N$292: U$4.26(A13)
N$293: U$5.10(A0)
N$294: U$5.9(A1)
N$295: U$5.8(A2)
N$296: U$5.7(A3)
N$297: U$5.6(A4)
N$298: U$5.5(A5)
N$299: U$5.4(A6)
N$300: U$5.3(A7)
N$301: U$5.25(A8)
N$302: U$5.24(A9)
N$303: U$5.21(A10)
N$304: U$5.23(A11)
N$305: U$5.2(A12)
N$306: U$5.26(A13)
N$307: IC140.7(A6) IC173.15(6Q)
N$308: IC140.8(A7) IC173.16(7Q)
N$309: IC140.9(A8) IC173.19(8Q)
N$310: IC166.2(1Q) IC171.2(A1)
N$311: IC166.5(2Q) IC171.3(A2)
N$312: IC97.11(3A) IC119.13(S3)
N$313: IC97.14(4A) IC119.10(S4)
N$314: IC103.2(1A) IC124.4(S1)
N$315: IC166.6(3Q) IC171.4(A3)
N$316: IC103.5(2A) IC124.1(S2)
N$317: IC103.11(3A) IC124.13(S3)
N$318: IC103.14(4A) IC124.10(S4)
N$319: IC104.2(1A) IC148.4(S1)
N$320: IC86.8(4D) IC226.9(A0)
N$321: IC104.5(2A) IC148.1(S2)
N$322: IC175.6(B:O) IC177.4(B:I0)
N$323: IC104.11(3A) IC148.13(S3)
N$324: IC177.6(B:O) IC192.4(B:I0)
N$325: IC3.2(A1) IC153.2(1Q)
N$326: IC3.3(A2) IC153.5(2Q)
N$327: IC3.4(A3) IC153.6(3Q)
N$328: IC3.5(A4) IC153.9(4Q)
N$329: IC3.6(A5) IC153.12(5Q)
N$330: IC3.7(A6) IC153.15(6Q)
N$331: IC3.8(A7) IC153.16(7Q)
N$332: IC3.9(A8) IC153.19(8Q)
N$333: IC50.5(A1)
N$334: IC50.3(A2)
N$335: IC50.14(A3)
N$336: IC50.12(A4)
N$337: IC52.5(A1)
N$338: IC51.5(A1)
N$339: IC51.3(A2)
N$340: IC51.14(A3)
N$341: IC51.12(A4)
N$342: IC146.2(A1) IC185.2(1Q)
N$343: IC104.14(4A) IC148.10(S4)
N$344: IC166.9(4Q) IC171.5(A4)
N$345: IC166.12(5Q) IC171.6(A5)
N$346: IC158.9(C:I0) IC190.8(C:O)
N$347: IC305.7(3D) IC308.9(3Y)
N$348: IC119.9(C4) IC124.7(C0)
N$349: IC149.3(B:I) IC226.14(GS)
N$350: IC52.3(A2)
N$351: IC52.14(A3)
N$352: IC52.12(A4)
N$353: IC53.5(A1)
N$354: IC53.3(A2)
N$355: IC158.8(C:O) IC226.11
N$356: IC149.4(B:O) IC240.2(A:I1)
N$357: IC50.9(C4) IC51.7(C0)
N$358: IC51.9(C4) IC52.7(C0)
N$359: IC52.9(C4) IC53.7(C0)
N$360: IC76.5(Q2)
N$361: IC226.15(EO) IC240.1(A:I0)
N$362: IC192.6(B:O) IC193.4(B:I0)
N$363: IC166.15(6Q) IC171.7(A6)
N$364: IC76.6(Q3)
N$365: IC93.8(C:O) IC226.3
N$366: IC93.10(C:I1) IC125.3(A2) IC162.5(Q2)
N$367: IC75.4(D2) U$1.12(I/O1)
N$368: IC132.9(C:I0) IC201.8(C:O)
N$369: IC75.7(D3) U$1.13(I/O2)
N$370: IC166.16(7Q) IC171.8(A7)
N$371: IC166.19(8Q) IC171.9(A8)
N$372: IC168.1(A:CLR) IC220.3(A:O)
N$373: IC146.3(A2) IC185.5(2Q)
N$374: IC174.1(A:CLR) IC223.3(A:O)
N$375: IC75.8(D4) U$1.15(I/O3)
N$376: IC75.13(D5) U$1.16(I/O4)
N$377: IC75.14(D6) U$1.17(I/O5)
N$378: IC60.3(D1) U$10.11(I/O0)
N$379: IC60.4(D2) U$10.12(I/O1)
N$380: IC60.7(D3) U$10.13(I/O2)
N$381: IC60.8(D4) U$10.15(I/O3)
N$382: IC60.13(D5) U$10.16(I/O4)
N$383: IC60.14(D6) U$10.17(I/O5)
N$384: IC60.17(D7) U$10.18(I/O6)
N$385: IC60.18(D8) U$10.19(I/O7)
N$386: IC61.3(D1) U$11.11(I/O0)
N$387: IC61.4(D2) U$11.12(I/O1)
N$388: IC188.1(A:CLR) IC224.3(A:O)
N$389: IC187.5(A:Q)
N$390: IC161.3(A:O)
N$391: IC76.9(Q4)
N$392: IC196.3(A:O)
N$393: IC211.3(A:O)
N$394: IC174.5(A:Q)
N$395: IC188.5(A:Q)
N$396: IC221.5(A:Q)
N$397: IC207.1(A:I0) IC222.7(Y7)
N$398: IC218.2(A:I1) IC222.14(Y1)
N$399: IC219.2(A:I1) IC222.13(Y2)
N$400: IC76.12(Q5)
N$401: IC76.15(Q6)
N$402: IC76.16(Q7)
N$403: IC222.11(Y4) IC223.1(A:I0)
N$404: IC4.5(2Q) IC111.13(B:A2)
N$405: IC222.9(Y6) IC225.1(A:I0)
N$406: IC187.1(A:CLR) IC207.3(A:O)
N$407: IC251.2(1Q) IC252.2(A1)
N$408: IC163.1(A:CLR) IC218.3(A:O)
N$409: IC164.1(A:CLR) IC219.3(A:O)
N$410: IC221.1(A:CLR) IC225.3(A:O)
N$411: IC125.4(A3) IC132.10(C:I1) IC162.6(Q3)
N$412: IC125.5(A4) IC150.10(C:I1) IC162.9(Q4)
N$413: IC132.8(C:O) IC226.2
N$414: IC125.6(A5) IC151.10(C:I1) IC162.12(Q5)
N$415: IC150.9(C:I0) IC203.8(C:O)
N$416: IC150.8(C:O) IC226.1
N$417: IC151.9(C:I0) IC206.8(C:O)
N$418: IC151.8(C:O) IC226.13
N$419: IC157.9(C:I0) IC228.8(C:O)
N$420: IC157.8(C:O) IC226.12
N$421: IC191.9(C:I0) IC242.8(C:O)
N$422: IC146.4(A3) IC185.6(3Q)
N$423: IC146.5(A4) IC185.9(4Q)
N$424: IC146.6(A5) IC185.12(5Q)
N$425: IC146.7(A6) IC185.15(6Q)
N$426: IC146.8(A7) IC185.16(7Q)
N$427: IC146.9(A8) IC185.19(8Q)
N$428: IC216.2(1Q) IC245.2(A1)
N$429: IC216.5(2Q) IC245.3(A2)
N$430: IC216.6(3Q) IC245.4(A3)
N$431: IC216.9(4Q) IC245.5(A4)
N$432: IC216.12(5Q) IC245.6(A5)
N$433: IC216.15(6Q) IC245.7(A6)
N$434: IC216.16(7Q) IC245.8(A7)
N$435: IC216.19(8Q) IC245.9(A8)
N$436: IC191.8(C:O) IC226.10
N$437: IC125.7(A6) IC157.10(C:I1) IC162.15(Q6)
N$438: IC125.8(A7) IC158.10(C:I1) IC162.16(Q7)
N$439: IC125.9(A8) IC162.19(Q8) IC191.10(C:I1)
N$440: IC76.19(Q8)
N$441: IC165.2(1Q) IC215.2(A1)
N$442: IC76.3(D1) U$2.11(I/O0)
N$443: IC76.4(D2) U$2.12(I/O1)
N$444: IC168.5(A:Q) IC211.2(A:I1)
N$445: IC193.6(B:O) IC194.4(B:I0)
N$446: IC197.5(A:O) IC198.1(A:I)
N$447: IC77.5(Q2)
N$448: IC61.7(D3) U$11.13(I/O2)
N$449: IC75.17(D7) U$1.18(I/O6)
N$450: IC75.18(D8) U$1.19(I/O7)
N$451: IC76.7(D3) U$2.13(I/O2)
N$452: IC76.8(D4) U$2.15(I/O3)
N$453: IC76.13(D5) U$2.16(I/O4)
N$454: IC76.14(D6) U$2.17(I/O5)
N$455: IC76.17(D7) U$2.18(I/O6)
N$456: IC76.18(D8) U$2.19(I/O7)
N$457: IC77.3(D1) U$3.11(I/O0)
N$458: IC77.4(D2) U$3.12(I/O1)
N$459: IC77.7(D3) U$3.13(I/O2)
N$460: IC77.8(D4) U$3.15(I/O3)
N$461: IC77.13(D5) U$3.16(I/O4)
N$462: IC77.14(D6) U$3.17(I/O5)
N$463: IC77.17(D7) U$3.18(I/O6)
N$464: IC77.18(D8) U$3.19(I/O7)
N$465: IC78.3(D1) U$4.11(I/O0)
N$466: IC78.4(D2) U$4.12(I/O1)
N$467: IC78.7(D3) U$4.13(I/O2)
N$468: IC78.8(D4) U$4.15(I/O3)
N$469: IC78.13(D5) U$4.16(I/O4)
N$470: IC78.14(D6) U$4.17(I/O5)
N$471: IC78.17(D7) U$4.18(I/O6)
N$472: IC78.18(D8) U$4.19(I/O7)
N$473: IC79.3(D1) U$5.11(I/O0)
N$474: IC79.4(D2) U$5.12(I/O1)
N$475: IC79.7(D3) U$5.13(I/O2)
N$476: IC79.8(D4) U$5.15(I/O3)
N$477: IC79.13(D5) U$5.16(I/O4)
N$478: IC79.14(D6) U$5.17(I/O5)
N$479: IC79.17(D7) U$5.18(I/O6)
N$480: IC79.18(D8) U$5.19(I/O7)
N$481: IC198.2(A:O) IC199.1(A:I0)
N$482: IC61.8(D4) U$11.15(I/O3)
N$483: IC61.13(D5) U$11.16(I/O4)
N$484: IC61.14(D6) U$11.17(I/O5)
N$485: IC61.17(D7) U$11.18(I/O6)
N$486: IC61.18(D8) U$11.19(I/O7)
N$487: IC62.3(D1) U$12.11(I/O0)
N$488: IC62.4(D2) U$12.12(I/O1)
N$489: IC62.7(D3) U$12.13(I/O2)
N$490: IC62.8(D4) U$12.15(I/O3)
N$491: IC62.13(D5) U$12.16(I/O4)
N$492: IC62.14(D6) U$12.17(I/O5)
N$493: IC62.17(D7) U$12.18(I/O6)
N$494: IC62.18(D8) U$12.19(I/O7)
N$495: IC194.6(B:O) IC200.4(B:I0)
N$496: IC200.6(B:O) IC209.4(B:I0)
N$497: IC165.5(2Q) IC215.3(A2)
N$498: IC165.6(3Q) IC215.4(A3)
N$499: IC165.9(4Q) IC215.5(A4)
N$500: IC165.12(5Q) IC215.6(A5)
N$501: IC165.15(6Q) IC215.7(A6)
N$502: IC165.16(7Q) IC215.8(A7)
N$503: IC134.18(D8) U$6.19(I/O7)
N$504: IC134.17(D7) U$6.18(I/O6)
N$505: IC134.14(D6) U$6.17(I/O5)
N$506: IC134.13(D5) U$6.16(I/O4)
N$507: IC134.8(D4) U$6.15(I/O3)
N$508: IC134.7(D3) U$6.13(I/O2)
N$509: IC134.4(D2) U$6.12(I/O1)
N$510: IC134.3(D1) U$6.11(I/O0)
N$511: IC135.3(D1) U$7.11(I/O0)
N$512: IC135.4(D2) U$7.12(I/O1)
N$513: IC135.7(D3) U$7.13(I/O2)
N$514: IC135.8(D4) U$7.15(I/O3)
N$515: IC135.13(D5) U$7.16(I/O4)
N$516: IC135.14(D6) U$7.17(I/O5)
N$517: IC135.17(D7) U$7.18(I/O6)
N$518: IC135.18(D8) U$7.19(I/O7)
N$519: IC136.3(D1) U$8.11(I/O0)
N$520: IC136.4(D2) U$8.12(I/O1)
N$521: IC136.7(D3) U$8.13(I/O2)
N$522: IC136.8(D4) U$8.15(I/O3)
N$523: IC136.13(D5) U$8.16(I/O4)
N$524: IC136.14(D6) U$8.17(I/O5)
N$525: IC136.17(D7) U$8.18(I/O6)
N$526: IC136.18(D8) U$8.19(I/O7)
N$527: IC137.3(D1) U$9.11(I/O0)
N$528: IC54.6(3Q) IC87.4(A3) IC139.4(A3)
N$529: IC54.15(6Q) IC139.7(A6)
N$530: IC251.5(2Q) IC252.3(A2)
N$531: IC54.16(7Q) IC139.8(A7)
N$532: IC54.19(8Q) IC139.9(A8)
N$533: IC137.4(D2) U$9.12(I/O1)
N$534: IC137.7(D3) U$9.13(I/O2)
N$535: IC137.8(D4) U$9.15(I/O3)
N$536: IC137.13(D5) U$9.16(I/O4)
N$537: IC137.14(D6) U$9.17(I/O5)
N$538: IC137.17(D7) U$9.18(I/O6)
N$539: IC137.18(D8) U$9.19(I/O7)
N$540: IC251.6(3Q) IC252.4(A3)
N$541: IC93.9(C:I0) IC152.8(C:O)
N$542: IC165.19(8Q) IC215.9(A8)
N$543: IC246.2(1Q) IC259.2(A1)
N$544: IC246.5(2Q) IC259.3(A2)
N$545: IC246.6(3Q) IC259.4(A3)
N$546: IC246.9(4Q) IC259.5(A4)
N$547: IC246.12(5Q) IC259.6(A5)
N$548: IC54.9(4Q) IC87.5(A4) IC139.5(A4)
N$549: IC246.15(6Q) IC259.7(A6)
N$550: IC246.16(7Q) IC259.8(A7)
N$551: IC246.19(8Q) IC259.9(A8)
N$552: IC217.2(1Q) IC260.2(A1)
N$553: IC217.5(2Q) IC260.3(A2)
N$554: IC217.6(3Q) IC260.4(A3)
N$555: IC217.9(4Q) IC260.5(A4)
N$556: IC217.12(5Q) IC260.6(A5)
N$557: IC217.15(6Q) IC260.7(A6)
N$558: IC217.16(7Q) IC260.8(A7)
N$559: IC217.19(8Q) IC260.9(A8)
N$560: IC262.2(1Q) IC263.2(A1)
N$561: IC262.5(2Q) IC263.3(A2)
N$562: IC262.6(3Q) IC263.4(A3)
N$563: IC262.9(4Q) IC263.5(A4)
N$564: IC77.6(Q3)
N$565: IC262.12(5Q) IC263.6(A5)
N$566: IC262.15(6Q) IC263.7(A6)
N$567: IC70.13(D6) IC81.6(B:O)
N$568: IC77.9(Q4)
N$569: IC18.6(B:O) IC70.12(D7)
N$570: IC262.16(7Q) IC263.8(A7)
N$571: IC77.12(Q5)
N$572: IC262.19(8Q) IC263.9(A8)
N$573: IC261.2(1Q) IC264.2(A1)
N$574: IC284.10(S4) IC303.9(A8)
N$575: IC28.2(A1) IC286.4(S1)
N$576: IC28.3(A2) IC286.1(S2)
N$577: IC4.6(3Q) IC111.15(B:A3)
N$578: IC4.9(4Q) IC111.17(B:A4)
N$579: IC4.12(5Q) IC112.11(B:A1)
N$580: IC4.15(6Q) IC112.13(B:A2)
N$581: IC4.16(7Q) IC112.15(B:A3)
N$582: IC4.19(8Q) IC112.17(B:A4)
N$583: IC98.2(1Q) IC113.2(A1)
N$584: IC98.5(2Q) IC113.3(A2)
N$585: IC98.6(3Q) IC113.4(A3)
N$586: IC98.9(4Q) IC113.5(A4)
N$587: IC98.12(5Q) IC113.6(A5)
N$588: IC98.15(6Q) IC113.7(A6)
N$589: IC98.16(7Q) IC113.8(A7)
N$590: IC98.19(8Q) IC113.9(A8)
N$591: IC99.2(1Q) IC114.2(A1)
N$592: IC99.5(2Q) IC114.3(A2)
N$593: IC99.6(3Q) IC114.4(A3)
N$594: IC99.9(4Q) IC114.5(A4)
N$595: IC99.12(5Q) IC114.6(A5)
N$596: IC99.15(6Q) IC114.7(A6)
N$597: IC99.16(7Q) IC114.8(A7)
N$598: IC261.5(2Q) IC264.3(A2)
N$599: IC261.6(3Q) IC264.4(A3)
N$600: IC261.9(4Q) IC264.5(A4)
N$601: IC28.4(A3) IC286.13(S3)
N$602: IC77.15(Q6)
N$603: IC28.5(A4) IC286.10(S4)
N$604: IC28.6(A5) IC287.4(S1)
N$605: IC77.16(Q7)
N$606: IC77.19(Q8)
N$607: IC261.12(5Q) IC264.6(A5)
N$608: IC261.15(6Q) IC264.7(A6)
N$609: IC261.16(7Q) IC264.8(A7)
N$610: IC261.19(8Q) IC264.9(A8)
N$611: IC251.9(4Q) IC252.5(A4)
N$612: IC251.12(5Q) IC252.6(A5)
N$613: IC251.15(6Q) IC252.7(A6)
N$614: IC251.16(7Q) IC252.8(A7)
N$615: IC251.19(8Q) IC252.9(A8)
N$616: IC202.2(1Q) IC253.2(A1)
N$617: IC202.5(2Q) IC253.3(A2)
N$618: IC202.6(3Q) IC253.4(A3)
N$619: IC202.9(4Q) IC253.5(A4)
N$620: IC202.12(5Q) IC253.6(A5)
N$621: IC202.15(6Q) IC253.7(A6)
N$622: IC202.16(7Q) IC253.8(A7)
N$623: IC202.19(8Q) IC253.9(A8)
N$624: IC265.2(1Q) IC266.2(A1)
N$625: IC265.5(2Q) IC266.3(A2)
N$626: IC265.6(3Q) IC266.4(A3)
N$627: IC265.9(4Q) IC266.5(A4)
N$628: IC265.12(5Q) IC266.6(A5)
N$629: IC265.15(6Q) IC266.7(A6)
N$630: IC265.16(7Q) IC266.8(A7)
N$631: IC265.19(8Q) IC266.9(A8)
N$632: IC254.2(1Q) IC267.2(A1)
N$633: IC254.5(2Q) IC267.3(A2)
N$634: IC254.6(3Q) IC267.4(A3)
N$635: IC254.9(4Q) IC267.5(A4)
N$636: IC254.12(5Q) IC267.6(A5)
N$637: IC254.15(6Q) IC267.7(A6)
N$638: IC254.16(7Q) IC267.8(A7)
N$639: IC254.19(8Q) IC267.9(A8)
N$640: IC239.3(B:I) IC240.6(A:O)
N$641: IC47.4(B:O) IC141.5(B:I2)
N$642: IC273.1(1G) IC273.15(2G) IC274.1(1G) IC274.15(2G) IC275.1(1G) IC275.15(2G) IC276.1(1G) IC276.15(2G) IC279.1(1G) IC279.15(2G) IC280.1(1G) IC280.15(2G) IC281.1(1G) IC281.15(2G) IC282.1(1G) IC282.15(2G)
N$643: IC268.4(1Y) IC285.6(B1)
N$644: IC268.7(2Y) IC285.2(B2)
N$645: IC268.9(3Y) IC285.15(B3)
N$646: IC268.12(4Y) IC285.11(B4)
N$647: IC56.6(B1) IC272.4(1Y)
N$648: IC56.2(B2) IC272.7(2Y)
N$649: IC56.15(B3) IC272.9(3Y)
N$650: IC56.11(B4) IC272.12(4Y)
N$651: IC277.4(1Y) IC283.6(B1)
N$652: IC277.7(2Y) IC283.2(B2)
N$653: IC277.9(3Y) IC283.15(B3)
N$654: IC277.12(4Y) IC283.11(B4)
N$655: IC28.7(A6) IC287.1(S2)
N$656: IC28.8(A7) IC287.13(S3)
N$657: IC28.9(A8) IC287.10(S4)
N$660: IC86.2(1Q) IC154.2(A1)
N$661: IC86.5(2Q) IC154.3(A2)
N$662: IC86.6(3Q) IC154.4(A3)
N$666: IC86.16(7Q) IC154.8(A7)
N$667: IC86.19(8Q) IC154.9(A8)
N$669: IC282.7(1Y) IC283.5(A1)
N$670: IC56.9(C4) IC283.7(C0)
N$671: IC283.9(C4) IC284.7(C0)
N$672: IC284.9(C4) IC286.7(C0)
N$673: IC286.9(C4) IC287.7(C0)
N$674: IC282.9(2Y) IC283.3(A2)
N$675: IC279.7(1Y) IC283.14(A3)
N$676: IC279.9(2Y) IC283.12(A4)
N$677: IC280.7(1Y) IC284.5(A1)
N$678: IC280.9(2Y) IC284.3(A2)
N$679: IC281.7(1Y) IC284.14(A3)
N$680: IC281.9(2Y) IC284.12(A4)
N$681: IC275.7(1Y) IC286.5(A1)
N$682: IC275.9(2Y) IC286.3(A2)
N$683: IC276.7(1Y) IC286.14(A3)
N$684: IC276.9(2Y) IC286.12(A4)
N$685: IC220.1(A:I0) IC222.12(Y3)
N$686: IC273.7(1Y) IC287.5(A1)
N$687: IC222.10(Y5) IC224.1(A:I0)
N$688: IC95.9(C4) IC119.7(C0)
N$689: IC124.9(C4) IC148.7(C0)
N$690: IC161.2(A:I1) IC163.5(A:Q)
N$691: IC164.5(A:Q) IC196.2(A:I1)
N$693: IC162.4(D2)
N$694: IC162.7(D3)
N$695: IC162.8(D4)
N$696: IC162.13(D5)
N$697: IC162.14(D6)
N$698: IC162.17(D7)
N$699: IC162.18(D8)
N$700: IC305.8(4D) IC308.12(4Y)
N$701: IC305.13(5D) IC306.4(1Y)
N$702: IC305.14(6D) IC306.7(2Y)
N$703: IC305.17(7D) IC306.9(3Y)
N$704: IC305.18(8D) IC306.12(4Y)
N$705: IC229.1(A:I0) IC232.6(B:O)
N$706: IC141.8(C:O) IC232.5(B:I1)
N$707: IC141.11(C:I2) IC233.4(B:O) IC269.4(A:I2)
N$708: IC43.4(B:O) IC45.1(A:I0) IC141.10(C:I1)
N$709: IC304.3(1D) IC309.4(1Y)
N$710: IC45.3(A:O) IC238.5(B:I1)
N$711: IC238.6(B:O) IC269.5(A:I3)
N$712: IC304.4(2D) IC309.7(2Y)
N$713: IC304.7(3D) IC309.9(3Y)
N$714: IC304.8(4D) IC309.12(4Y)
N$715: IC304.13(5D) IC307.4(1Y)
N$716: IC304.14(6D) IC307.7(2Y)
N$717: IC304.17(7D) IC307.9(3Y)
N$718: IC304.18(8D) IC307.12(4Y)
N$719: IC304.19(8Q) IC307.10(3B) IC311.9(A8) IC312.1(A:I0)
N$720: IC304.16(7Q) IC307.6(2B) IC311.8(A7)
N$721: IC304.15(6Q) IC307.3(1B) IC311.7(A6)
N$722: IC273.9(2Y) IC287.3(A2)
N$723: IC274.7(1Y) IC287.14(A3)
N$724: IC274.9(2Y) IC287.12(A4)
N$725: IC288.18(A:Y1)
N$726: IC288.16(A:Y2)
N$727: IC288.14(A:Y3)
N$728: IC288.12(A:Y4)
N$729: IC291.18(A:Y1)
N$730: IC291.16(A:Y2)
N$731: IC291.14(A:Y3)
N$732: IC291.12(A:Y4)
N$733: IC290.18(A:Y1)
N$734: IC290.16(A:Y2)
N$735: IC290.14(A:Y3)
N$736: IC290.12(A:Y4)
N$737: IC288.2(A:A1) IC291.2(A:A1) IC292.2(A:A1) IC301.2(1Q)
N$738: IC288.4(A:A2) IC291.4(A:A2) IC292.4(A:A2) IC301.5(2Q)
N$739: IC288.6(A:A3) IC291.6(A:A3) IC292.6(A:A3) IC301.6(3Q)
N$740: IC288.8(A:A4) IC291.8(A:A4) IC292.8(A:A4) IC301.9(4Q)
N$741: IC289.2(A:A1) IC290.2(A:A1) IC293.2(A:A1) IC301.12(5Q)
N$742: IC289.4(A:A2) IC290.4(A:A2) IC293.4(A:A2) IC301.15(6Q)
N$743: IC289.6(A:A3) IC290.6(A:A3) IC293.6(A:A3) IC301.16(7Q)
N$744: IC289.8(A:A4) IC290.8(A:A4) IC293.8(A:A4) IC301.19(8Q)
N$745: IC292.18(A:Y1)
N$746: IC292.16(A:Y2)
N$747: IC292.14(A:Y3)
N$748: IC292.12(A:Y4)
N$749: IC293.18(A:Y1)
N$750: IC293.16(A:Y2)
N$751: IC293.14(A:Y3)
N$752: IC293.12(A:Y4)
N$753: IC295.2(A:A1) IC296.2(1Q) IC298.2(A:A1) IC299.2(A:A1)
N$754: IC295.4(A:A2) IC296.5(2Q) IC298.4(A:A2) IC299.4(A:A2)
N$755: IC295.6(A:A3) IC296.6(3Q) IC298.6(A:A3) IC299.6(A:A3)
N$756: IC295.8(A:A4) IC296.9(4Q) IC298.8(A:A4) IC299.8(A:A4)
N$757: IC294.2(A:A1) IC296.12(5Q) IC297.2(A:A1) IC300.2(A:A1)
N$758: IC294.4(A:A2) IC296.15(6Q) IC297.4(A:A2) IC300.4(A:A2)
N$759: IC294.6(A:A3) IC296.16(7Q) IC297.6(A:A3) IC300.6(A:A3)
N$760: IC294.8(A:A4) IC296.19(8Q) IC297.8(A:A4) IC300.8(A:A4)
N$761: IC285.4(S1) IC302.2(A1)
N$762: IC285.1(S2) IC302.3(A2)
N$763: IC285.13(S3) IC302.4(A3)
N$764: IC285.10(S4) IC302.5(A4)
N$781: IC54.12(5Q) IC87.6(A5) IC139.6(A5)
N$782: IC304.12(5Q) IC309.13(4B) IC311.6(A5)
N$783: IC304.9(4Q) IC309.10(3B) IC311.5(A4)
N$784: IC304.6(3Q) IC309.6(2B) IC311.4(A3)
N$785: IC304.5(2Q) IC309.3(1B) IC311.3(A2)
N$786: IC305.19(8Q) IC306.10(3B) IC310.9(A8)
N$787: IC305.16(7Q) IC306.6(2B) IC310.8(A7)
N$788: IC305.15(6Q) IC306.3(1B) IC310.7(A6)
N$789: IC305.12(5Q) IC308.13(4B) IC310.6(A5)
N$790: IC305.9(4Q) IC308.10(3B) IC310.5(A4)
N$791: IC305.6(3Q) IC308.6(2B) IC310.4(A3)
N$792: IC305.5(2Q) IC308.3(1B) IC310.3(A2)
N$793: IC304.2(1Q) IC306.13(4B) IC311.2(A1)
N$794: IC307.13(4B) IC312.3(A:O)
N$1062: IC411.3(A:S2) R23.1 S3.1(O)
N$1063: IC411.1(A:R) R24.1 S3.3(S)
N$1067: IC410.3(B:I) IC412.3(Q1)
N$1068: IC126.3(B:I) IC412.7(CLK) SW1.C
N$1069: IC412.1(M) IC412.2(N) IC415.6(B:O)
N$1218: IC29.2(A1) IC44.2(A1) IC544.2(1Q)
N$1219: IC29.3(A2) IC44.3(A2) IC544.5(2Q)
N$1220: IC29.4(A3) IC44.4(A3) IC544.6(3Q)
N$1222: IC44.7(A6) IC544.15(6Q)
N$1223: IC44.8(A7) IC544.16(7Q)
N$1224: IC44.9(A8) IC544.19(8Q)
N$1560: IC29.5(A4) IC44.5(A4) IC544.9(4Q)
NORMAL_CLK: SW1.2
NOT_COND: IC74.4(B:I0)
NOT_RST: IC75.1(CLR) IC76.1(CLR) IC77.1(CLR) IC78.1(CLR) IC79.1(CLR) IC134.1(CLR) IC135.1(CLR) IC136.1(CLR) IC137.1(CLR)
OF: IC122.5(A4) IC156.10(2C0) IC227.9(Q4) IC256.6(1C0)
OF_FROM_ALU: IC127.3(1B) IC156.12(2C2) IC256.5(1C1)
OF_IN_SRC_0: IC256.14(A)
OF_IN_SRC_1: IC256.2(B)
PANEL_MEM_IO: RN4.3
PANEL_RD: RN4.1
PANEL_WR: RN4.2
PC_H_0: IC277.3(1B)
PC_H_1: IC277.6(2B)
PC_H_2: IC277.10(3B)
PC_H_3: IC277.13(4B)
PC_H_4: IC278.3(1B)
PC_H_5: IC278.6(2B)
PC_H_6: IC278.10(3B)
PC_H_7: IC278.13(4B)
PC_H_OUT: IC107.19(B:G) IC108.19(B:G)
PC_H_WRT: IC6.1(G)
PC_IN_SRC: IC96.1(!A!/B) IC97.1(!A!/B) IC103.1(!A!/B) IC104.1(!A!/B)
PC_L_0: IC268.3(1B)
PC_L_1: IC268.6(2B)
PC_L_2: IC268.10(3B)
PC_L_3: IC268.13(4B)
PC_L_4: IC272.3(1B)
PC_L_5: IC272.6(2B)
PC_L_6: IC272.10(3B)
PC_L_7: IC272.13(4B)
PC_L_OUT: IC105.19(B:G) IC106.19(B:G)
PC_L_WRT: IC48.1(G)
PC_MAR_ADDER_OUT_0: IC48.3(1D) IC96.4(1Y)
PC_MAR_ADDER_OUT_1: IC48.4(2D) IC96.7(2Y)
PC_MAR_ADDER_OUT_15: IC6.18(8D) IC104.12(4Y)
PCH_0: IC6.2(1Q) IC107.11(B:A1)
PCH_1: IC6.5(2Q) IC107.13(B:A2)
PCH_2: IC6.6(3Q) IC107.15(B:A3)
PCH_3: IC6.9(4Q) IC107.17(B:A4)
PCH_4: IC6.12(5Q) IC108.11(B:A1)
PCH_5: IC6.15(6Q) IC108.13(B:A2)
PCH_6: IC6.16(7Q) IC108.15(B:A3)
PCH_7: IC6.19(8Q) IC108.17(B:A4)
PCL_0: IC48.2(1Q) IC105.11(B:A1)
PCL_1: IC48.5(2Q) IC105.13(B:A2)
PCL_2: IC48.6(3Q) IC105.15(B:A3)
PCL_3: IC48.9(4Q) IC105.17(B:A4)
PCL_4: IC48.12(5Q) IC106.11(B:A1)
PCL_5: IC48.15(6Q) IC106.13(B:A2)
PCL_6: IC48.16(7Q) IC106.15(B:A3)
PCL_7: IC48.19(8Q) IC106.17(B:A4)
PF: IC70.15(D4) IC122.6(A5) IC208.6(1C0) IC227.12(Q5)
PF_FROM_ALU: IC59.2(A:O) IC208.5(1C1)
PF_IN_SRC_0: IC208.14(A)
PF_IN_SRC_1: IC208.2(B)
PROG_MODE: IC250.5(B:I1)
RD: IC60.2(Q1) IC69.11(B:A1)
RST: IC128.15(CLR) IC144.15(CLR) IC248.15(CLR) IC249.15(CLR) IC412.15(CLR) IC414.3(B:I) R25.1 S5.2(P)
SF: IC122.4(A3) IC156.6(1C0) IC227.6(Q3) IC255.6(1C0)
SF_FROM_ALU: IC121.3(1B) IC156.4(1C2)
SF_IN_SRC_0: IC255.14(A)
SF_IN_SRC_1: IC255.2(B)
SF_XOR_OF: IC70.14(D5) IC72.6(B:O) IC81.4(B:I0)
SHR_MACHINE_H_OUT: IC311.1(G1) IC311.19(G2)
SHR_MACHINE_H_WRT: IC304.1(G)
SHR_MACHINE_IN_SRC: IC306.1(!A!/B) IC307.1(!A!/B) IC308.1(!A!/B) IC309.1(!A!/B)
SHR_MACHINE_L_OUT: IC310.1(G1) IC310.19(G2)
SHR_MACHINE_L_WRT: IC305.1(G)
SHR_MACHINE_TYPE: IC312.2(A:I1)
SHR_MSB_SRC_2: IC19.9(C)
SI_H_OUT: IC253.1(G1) IC253.19(G2)
SI_H_WRT: IC202.1(G)
SI_L_OUT: IC252.1(G1) IC252.19(G2)
SI_L_WRT: IC251.1(G)
SINGLE_STEP_CLK: IC411.4(A:Q) SW1.1
SPH_OUT: IC111.19(B:G) IC112.19(B:G)
SPH_WRT: IC4.1(G)
SPL_OUT: IC109.19(B:G) IC110.19(B:G)
SPL_WRT: IC5.1(G)
SS_H_0: IC275.4(1C2)
SS_H_1: IC275.12(2C2)
SS_H_2: IC276.4(1C2)
SS_H_3: IC276.12(2C2)
SS_H_4: IC273.4(1C2)
SS_H_5: IC273.12(2C2)
SS_H_6: IC274.4(1C2)
SS_H_7: IC274.12(2C2)
SS_H_OUT: IC260.1(G1) IC260.19(G2)
SS_H_WRT: IC217.1(G)
SS_L_0: IC282.4(1C2)
SS_L_1: IC282.12(2C2)
SS_L_2: IC279.4(1C2)
SS_L_3: IC279.12(2C2)
SS_L_4: IC280.4(1C2)
SS_L_5: IC280.12(2C2)
SS_L_6: IC281.4(1C2)
SS_L_7: IC281.12(2C2)
SS_L_OUT: IC259.1(G1) IC259.19(G2)
SS_L_WRT: IC246.1(G)
STOP_CLK: IC413.2(A:D) IC413.5(A:Q) IC415.4(B:I0) R26.1 S6.2(P)
TDR0_L_WRT: IC54.1(G) IC544.1(G)
TDR_H_X_OUT: IC87.1(G1) IC87.19(G2)
TDR_H_Y_OUT: IC139.1(G1) IC139.19(G2)
TDR_L_X_OUT: IC29.1(G1) IC29.19(G2)
TDR_L_Y_OUT: IC44.1(G1) IC44.19(G2)
TRAP_ACK: IC94.3(B:I)
TRAP_PENDING: IC141.6(B:O) IC232.4(B:I0) IC233.3(B:I) IC235.11(C:I2)
TRAP_REQ: IC39.3(A:CLK) IC141.3(B:I0) R1.2 R2.1
TRISTATE: IC28.1(G1) IC28.19(G2) IC69.19(B:G) IC250.6(B:O) IC302.1(G1) IC302.19(G2) IC303.1(G1) IC303.19(G2)
TYP0: IC214.5(B:I1) IC230.3(B:I)
TYP1: IC213.2(A:I1) IC235.9(C:I0) IC269.1(A:I0)
TYP_0: IC85.1(A:I0)
TYP_1: IC84.3(B:I)
U_AD0: IC32.2(Q1) U$6.10(A0) U$7.10(A0) U$8.10(A0) U$9.10(A0)
U_AD1: IC32.5(Q2) U$6.9(A1) U$7.9(A1) U$8.9(A1) U$9.9(A1)
U_AD2: IC32.6(Q3) U$6.8(A2) U$7.8(A2) U$8.8(A2) U$9.8(A2)
U_AD3: IC32.9(Q4) U$6.7(A3) U$7.7(A3) U$8.7(A3) U$9.7(A3)
U_AD4: IC32.12(Q5) U$6.6(A4) U$7.6(A4) U$8.6(A4) U$9.6(A4)
U_AD5: IC32.15(Q6) U$6.5(A5) U$7.5(A5) U$8.5(A5) U$9.5(A5)
U_AD6: IC32.16(Q7) U$6.4(A6) U$7.4(A6) U$8.4(A6) U$9.4(A6)
U_AD7: IC32.19(Q8) U$6.3(A7) U$7.3(A7) U$8.3(A7) U$9.3(A7)
U_AD8: IC33.2(Q1) U$6.25(A8) U$7.25(A8) U$8.25(A8) U$9.25(A8)
U_AD9: IC33.5(Q2) U$6.24(A9) U$7.24(A9) U$8.24(A9) U$9.24(A9)
U_AD10: IC33.6(Q3) U$6.21(A10) U$7.21(A10) U$8.21(A10) U$9.21(A10)
U_AD11: IC33.9(Q4) U$6.23(A11) U$7.23(A11) U$8.23(A11) U$9.23(A11)
U_AD12: IC33.12(Q5) U$6.2(A12) U$7.2(A12) U$8.2(A12) U$9.2(A12)
U_AD13: IC33.15(Q6) U$6.26(A13) U$7.26(A13) U$8.26(A13) U$9.26(A13)
U_AD14: IC33.16(Q7) IC53.14(A3)
U_AD15: IC33.19(Q8) IC53.12(A4)
U_AD_BUFF0: U$1.10(A0)
U_AD_BUFF1: U$1.9(A1)
U_AD_BUFF2: U$1.8(A2)
U_AD_BUFF3: U$1.7(A3)
U_AD_BUFF4: U$1.6(A4)
U_AD_BUFF5: U$1.5(A5)
U_AD_BUFF6: U$1.4(A6)
U_AD_BUFF7: U$1.3(A7)
U_AD_BUFF8: U$1.25(A8)
U_AD_BUFF9: U$1.24(A9)
U_AD_BUFF10: U$1.21(A10)
U_AD_BUFF11: U$1.23(A11)
U_AD_BUFF12: U$1.2(A12)
U_AD_BUFF13: U$1.26(A13)
U_ADDER_0: IC50.4(S1) IC186.4(D0)
U_ADDER_1: IC160.4(D0)
U_ADDER_2: IC159.4(D0)
U_ADDER_3: IC142.4(D0)
U_ADDER_4: IC129.4(D0)
U_ADDER_5: IC73.4(D0)
U_ADDER_6: IC34.4(D0)
U_ADDER_7: IC35.4(D0)
U_ADDER_8: IC36.4(D0)
U_ADDER_9: IC37.4(D0)
U_ADDER_10: IC38.4(D0)
U_ADDER_11: IC40.4(D0)
U_ADDER_12: IC41.4(D0)
U_ADDER_13: IC53.1(S2) IC71.4(D0)
U_ADDER_14: IC20.4(D0)
U_ADDER_15: IC172.4(D0)
U_CF: IC16.15(D4) IC17.1(A:I) IC155.11(2C1) IC231.5(Q2) IC270.6(1C0)
U_CF_IN_SRC_0: IC270.14(A)
U_CF_IN_SRC_1: IC270.2(B)
U_DMA_0: IC186.15(D4)
U_DMA_1: IC160.15(D4)
U_DMA_2: IC159.15(D4)
U_DMA_3: IC142.15(D4)
U_DMA_4: IC129.15(D4)
U_DMA_5: IC73.15(D4)
U_DMA_6: IC34.15(D4)
U_DMA_7: IC35.15(D4)
U_DMA_8: IC36.15(D4)
U_DMA_9: IC37.15(D4)
U_DMA_10: IC38.15(D4)
U_DMA_11: IC40.15(D4)
U_DMA_12: IC41.15(D4)
U_DMA_13: IC71.15(D4)
U_DMA_14: IC20.15(D4)